# Altium project EDU_High-Speed-Design.PrjPcb (part 2 of 5)

## Sheet EDU_High-Speed-Design_CPU_Audio.SchDoc: CPU Audio
size 279 x 215 mm; Date: not used; ApprovedBy: not used; CheckedBy: not used; Author: not used; DrawnBy: not used; Engineer: Podlesnyi Vasilii; Organization: not used; Address4: not used; Revision: 0.1; SheetNumber: 25; SheetTotal: 27; ProjectTitle: EDU High-Speed Design; Time: not used; ImagePath: not used; Application_BuildNumber: not used
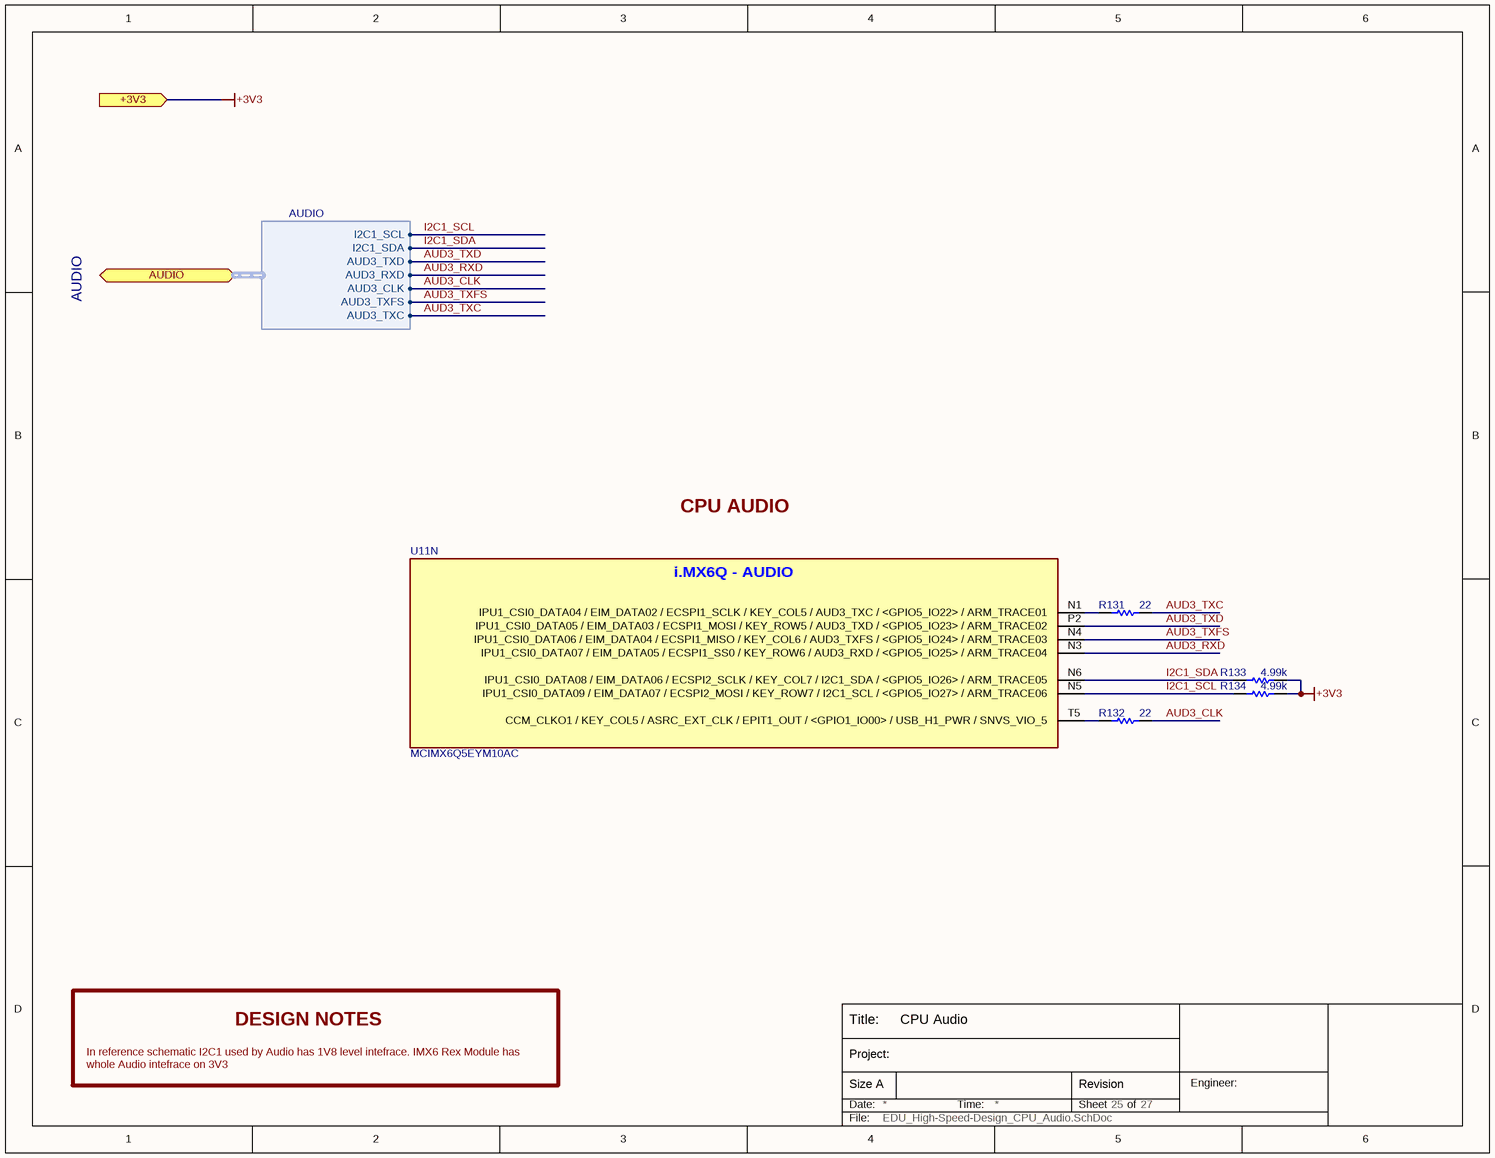
[diagram p9: EDU_High-Speed-Design_CPU_Audio.SchDoc]

### Parts
R131  22  [R0402]
R132  22  [R0402]
R133  4.99k  [R0402]
R134  4.99k  [R0402]
U11  MCIMX6Q5EYM10AC  [MCIMX6Q5EYM10AC]  (part N of 15)

### Ports
+3V3 (in), AUDIO (bidir, harness AUDIO)

### Harnesses
AUDIO: I2C1_SCL, AUD3_TXD, AUD3_RXD, I2C1_SDA, AUD3_CLK, AUD3_TXFS, AUD3_TXC

### Nets
+3V3: R133.2 R134.2 ; port +3V3
AUD3_CLK: R132.1 ; port AUDIO.AUD3_CLK
AUD3_RXD: U11.N3(IPU1_CSI0_DATA07_/_EIM_DATA05_/_ECSPI1_SS0_/_KEY_ROW6_/_AUD3_RXD_/_<GPIO5_IO25>_/_ARM_TRACE04) ; port AUDIO.AUD3_RXD
AUD3_TXC: R131.1 ; port AUDIO.AUD3_TXC
AUD3_TXD: U11.P2(IPU1_CSI0_DATA05_/_EIM_DATA03_/_ECSPI1_MOSI_/_KEY_ROW5_/_AUD3_TXD_/_<GPIO5_IO23>_/_ARM_TRACE02) ; port AUDIO.AUD3_TXD
AUD3_TXFS: U11.N4(IPU1_CSI0_DATA06_/_EIM_DATA04_/_ECSPI1_MISO_/_KEY_COL6_/_AUD3_TXFS_/_<GPIO5_IO24>_/_ARM_TRACE03) ; port AUDIO.AUD3_TXFS
I2C1_SCL: R134.1 U11.N5(IPU1_CSI0_DATA09_/_EIM_DATA07_/_ECSPI2_MOSI_/_KEY_ROW7_/_I2C1_SCL_/_<GPIO5_IO27>_/_ARM_TRACE06) ; port AUDIO.I2C1_SCL
I2C1_SDA: R133.1 U11.N6(IPU1_CSI0_DATA08_/_EIM_DATA06_/_ECSPI2_SCLK_/_KEY_COL7_/_I2C1_SDA_/_<GPIO5_IO26>_/_ARM_TRACE05) ; port AUDIO.I2C1_SDA
NetR131_2: R131.2 U11.N1(IPU1_CSI0_DATA04_/_EIM_DATA02_/_ECSPI1_SCLK_/_KEY_COL5_/_AUD3_TXC_/_<GPIO5_IO22>_/_ARM_TRACE01)
NetR132_2: R132.2 U11.T5(CCM_CLKO1_/_KEY_COL5_/_ASRC_EXT_CLK_/_EPIT1_OUT_/_<GPIO1_IO00>_/_USB_H1_PWR_/_SNVS_VIO_5)

### Notes on the sheet
- AUDIO
- CPU AUDIO
- DESIGN NOTES
- In reference schematic I2C1 used by Audio has 1V8 level intefrace. IMX6 Rex Module has whole Audio intefrace on 3V3
- Title:
- Date:
- Size A
- Project:
- Time:
- Sheet
- Revision
- of
- Engineer:
- File:
- (in symbol MCIMX6Q5EYM10AC, part N) i.MX6Q - AUDIO

### Library data of the parts
R131 R132 = RC0402FR-0722RL: as R154 on sheet EDU_High-Speed-Design_CPU_Control; Manufacturer Part Number 1: RC0402FR-0722RL; Resistance: 22; Supplier 1: Digi-Key; Supplier Part Number 1: 311-22.0LRCT-ND; ComponentLink1URL: http://www.yageo.com/documents/recent/PYu-RC0402_51_RoHS_L_6.pdf; ComponentLink1Description: http://www.yageo.com/documents/recent/PYu-RC0402_51_RoHS_L_6.pdf
R133 R134 = RMCF0402FT4K99: as R143 on sheet EDU_High-Speed-Design_CPU_Control; Manufacturer Part Number 1: RMCF0402FT4K99; Resistance: 4.99k; Supplier 1: Digi-Key; Supplier Part Number 1: RMCF0402FT4K99CT-ND; ComponentLink1URL: http://www.seielect.com/Catalog/SEI-RMCF.pdf; ComponentLink1Description: http://www.seielect.com/Catalog/SEI-RMCF.pdf
U11 = MCIMX6Q5EYM10AC: as U11 on sheet EDU_High-Speed-Design_CPU_Unused; Supplier 1: Digi-Key; Manufacturer Part Number 1: MCIMX6Q5EYM10AC; Supplier Part Number 1: MCIMX6Q5EYM10AC-ND

## Sheet EDU_High-Speed-Design_CPU_Ethernet.SchDoc: CPU Ethernet
size 279 x 215 mm; Date: not used; ApprovedBy: not used; CheckedBy: not used; Author: not used; DrawnBy: not used; Engineer: Podlesnyi Vasilii; Organization: not used; Address4: not used; Revision: 0.1; SheetNumber: 17; SheetTotal: 26; ProjectTitle: EDU High-Speed Design; Time: not used; ImagePath: not used; Application_BuildNumber: not used
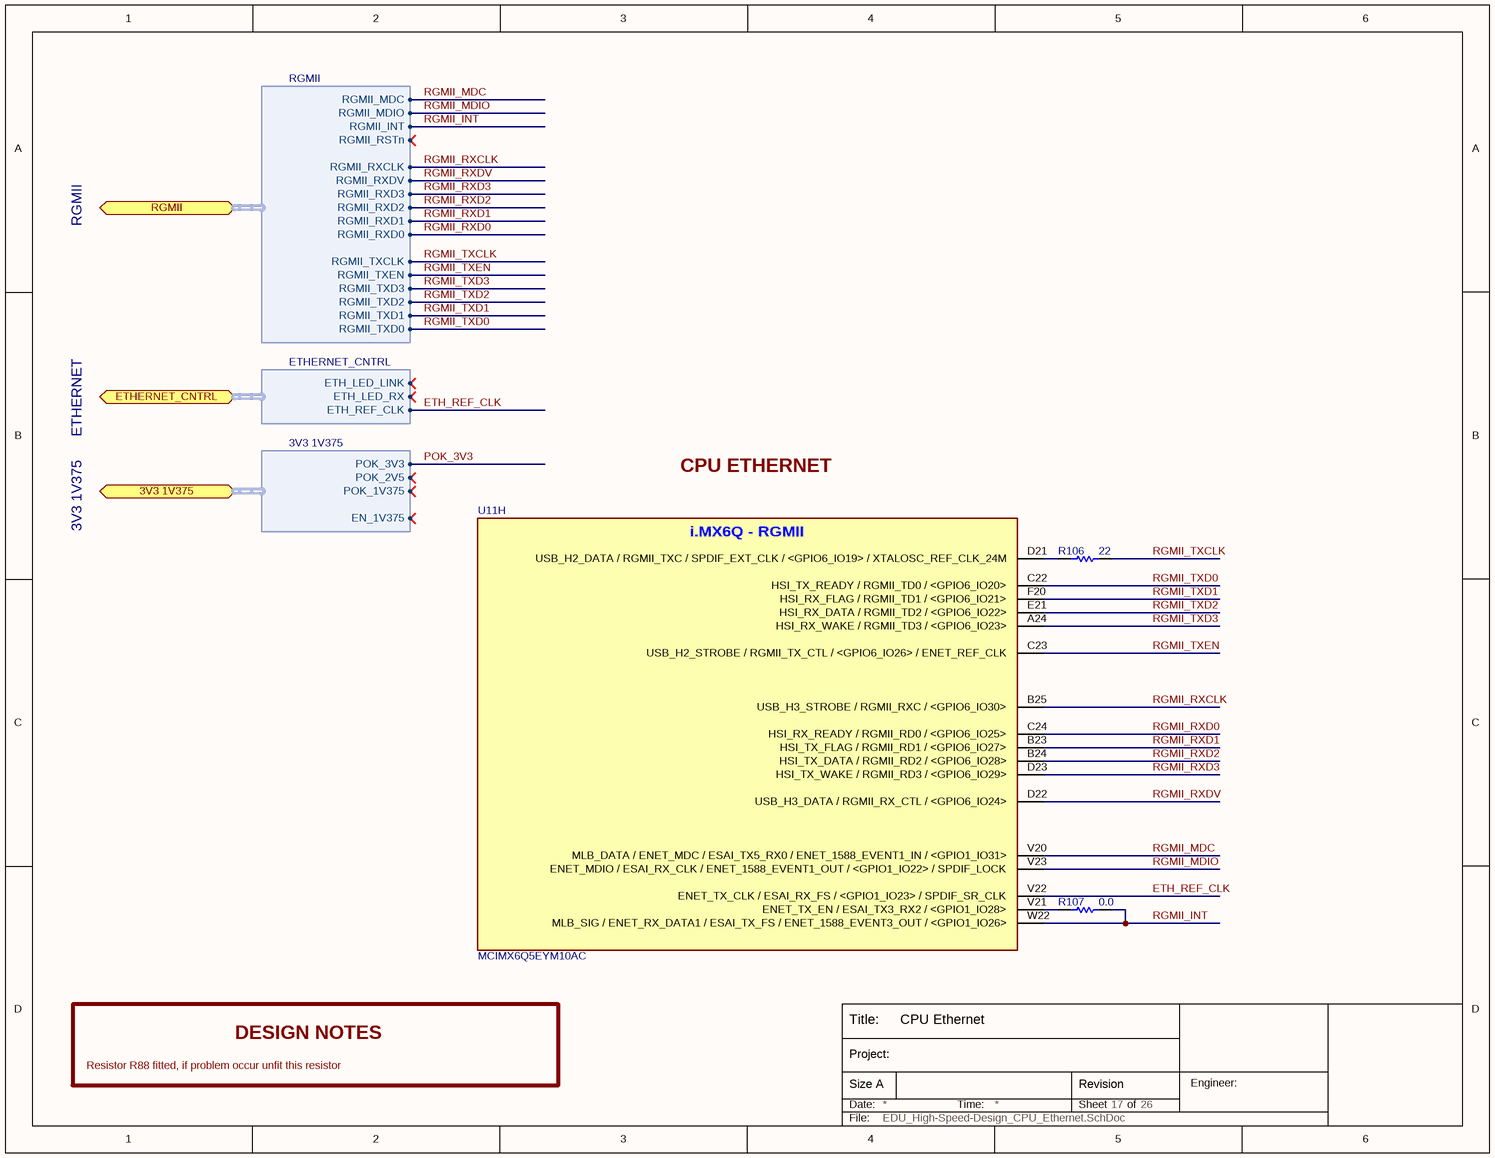
[diagram p10: EDU_High-Speed-Design_CPU_Ethernet.SchDoc]

### Parts
R106  22  [R0402]
R107  0.0  [R0402]
U11  MCIMX6Q5EYM10AC  [MCIMX6Q5EYM10AC]  (part H of 15)

### Ports
3V3 1V375 (bidir, harness 3V3 1V375), ETHERNET_CNTRL (bidir, harness ETHERNET_CNTRL), RGMII (bidir, harness RGMII)

### Harnesses
RGMII: RGMII_TXCLK, RGMII_TXEN, RGMII_TXD2, RGMII_TXD0, RGMII_TXD1, RGMII_TXD3, RGMII_RXDV, RGMII_RXCLK, RGMII_RXD3, RGMII_RXD2, RGMII_RXD1, RGMII_RXD0, RGMII_RSTn, RGMII_INT, RGMII_MDIO, RGMII_MDC
ETHERNET_CNTRL: ETH_LED_LINK, ETH_REF_CLK, ETH_LED_RX
3V3 1V375: POK_3V3, POK_1V375, POK_2V5, EN_1V375

### Nets
ETH_REF_CLK: U11.V22(ENET_TX_CLK_/_ESAI_RX_FS_/_<GPIO1_IO23>_/_SPDIF_SR_CLK) ; port ETHERNET_CNTRL.ETH_REF_CLK
RGMII_INT: R107.1 U11.W22(MLB_SIG_/_ENET_RX_DATA1_/_ESAI_TX_FS_/_ENET_1588_EVENT3_OUT_/_<GPIO1_IO26>) ; port RGMII.RGMII_INT
RGMII_MDC: U11.V20(MLB_DATA_/_ENET_MDC_/_ESAI_TX5_RX0_/_ENET_1588_EVENT1_IN_/_<GPIO1_IO31>) ; port RGMII.RGMII_MDC
RGMII_MDIO: U11.V23(ENET_MDIO_/_ESAI_RX_CLK_/_ENET_1588_EVENT1_OUT_/_<GPIO1_IO22>_/_SPDIF_LOCK) ; port RGMII.RGMII_MDIO
RGMII_RXCLK: U11.B25(USB_H3_STROBE_/_RGMII_RXC_/_<GPIO6_IO30>) ; port RGMII.RGMII_RXCLK
RGMII_RXD0: U11.C24(HSI_RX_READY_/_RGMII_RD0_/_<GPIO6_IO25>) ; port RGMII.RGMII_RXD0
RGMII_RXD1: U11.B23(HSI_TX_FLAG_/_RGMII_RD1_/_<GPIO6_IO27>) ; port RGMII.RGMII_RXD1
RGMII_RXD2: U11.B24(HSI_TX_DATA_/_RGMII_RD2_/_<GPIO6_IO28>) ; port RGMII.RGMII_RXD2
RGMII_RXD3: U11.D23(HSI_TX_WAKE_/_RGMII_RD3_/_<GPIO6_IO29>) ; port RGMII.RGMII_RXD3
RGMII_RXDV: U11.D22(USB_H3_DATA_/_RGMII_RX_CTL_/_<GPIO6_IO24>) ; port RGMII.RGMII_RXDV
RGMII_TXCLK: R106.1 ; port RGMII.RGMII_TXCLK
RGMII_TXD0: U11.C22(HSI_TX_READY_/_RGMII_TD0_/_<GPIO6_IO20>) ; port RGMII.RGMII_TXD0
RGMII_TXD1: U11.F20(HSI_RX_FLAG_/_RGMII_TD1_/_<GPIO6_IO21>) ; port RGMII.RGMII_TXD1
RGMII_TXD2: U11.E21(HSI_RX_DATA_/_RGMII_TD2_/_<GPIO6_IO22>) ; port RGMII.RGMII_TXD2
RGMII_TXD3: U11.A24(HSI_RX_WAKE_/_RGMII_TD3_/_<GPIO6_IO23>) ; port RGMII.RGMII_TXD3
RGMII_TXEN: U11.C23(USB_H2_STROBE_/_RGMII_TX_CTL_/_<GPIO6_IO26>_/_ENET_REF_CLK) ; port RGMII.RGMII_TXEN
NetR106_2: R106.2 U11.D21(USB_H2_DATA_/_RGMII_TXC_/_SPDIF_EXT_CLK_/_<GPIO6_IO19>_/_XTALOSC_REF_CLK_24M)
NetR107_2: R107.2 U11.V21(ENET_TX_EN_/_ESAI_TX3_RX2_/_<GPIO1_IO28>)

### Notes on the sheet
- RGMII
- ETHERNET
- CPU ETHERNET
- 3V3 1V375
- DESIGN NOTES
- Resistor R88 fitted, if problem occur unfit this resistor
- Title:
- Date:
- Size A
- Project:
- Time:
- Sheet
- Revision
- of
- Engineer:
- File:
- (in symbol MCIMX6Q5EYM10AC, part H) i.MX6Q - RGMII

### Library data of the parts
R106 = RC0402FR-0722RL: as R154 on sheet EDU_High-Speed-Design_CPU_Control; Manufacturer Part Number 1: RC0402FR-0722RL; Resistance: 22; Supplier 1: Digi-Key; Supplier Part Number 1: 311-22.0LRCT-ND; ComponentLink1URL: http://www.yageo.com/documents/recent/PYu-RC0402_51_RoHS_L_6.pdf; ComponentLink1Description: http://www.yageo.com/documents/recent/PYu-RC0402_51_RoHS_L_6.pdf
R107 = RC0402JR-070RL: as R76 on sheet EDU_High-Speed-Design_CPU_Power; Manufacturer Part Number 1: RC0402JR-070RL; Resistance: 0.0; Supplier 1: Digi-Key; Supplier Part Number 1: 311-0.0JRCT-ND; ComponentLink1URL: http://www.yageo.com/documents/recent/PYu-RC0402_51_RoHS_L_6.pdf; ComponentLink1Description: http://www.yageo.com/documents/recent/PYu-RC0402_51_RoHS_L_6.pdf
U11 = MCIMX6Q5EYM10AC: as U11 on sheet EDU_High-Speed-Design_CPU_Unused; Supplier 1: Digi-Key; Manufacturer Part Number 1: MCIMX6Q5EYM10AC; Supplier Part Number 1: MCIMX6Q5EYM10AC-ND

## Sheet EDU_High-Speed-Design_CPU_USB.SchDoc: CPU USB
size 279 x 215 mm; Date: not used; ApprovedBy: not used; CheckedBy: not used; Author: not used; DrawnBy: not used; Engineer: Podlesnyi Vasilii; Organization: not used; Address4: not used; Revision: 0.1; SheetNumber: 18; SheetTotal: 26; ProjectTitle: EDU High-Speed Design; Time: not used; ImagePath: not used; Application_BuildNumber: not used
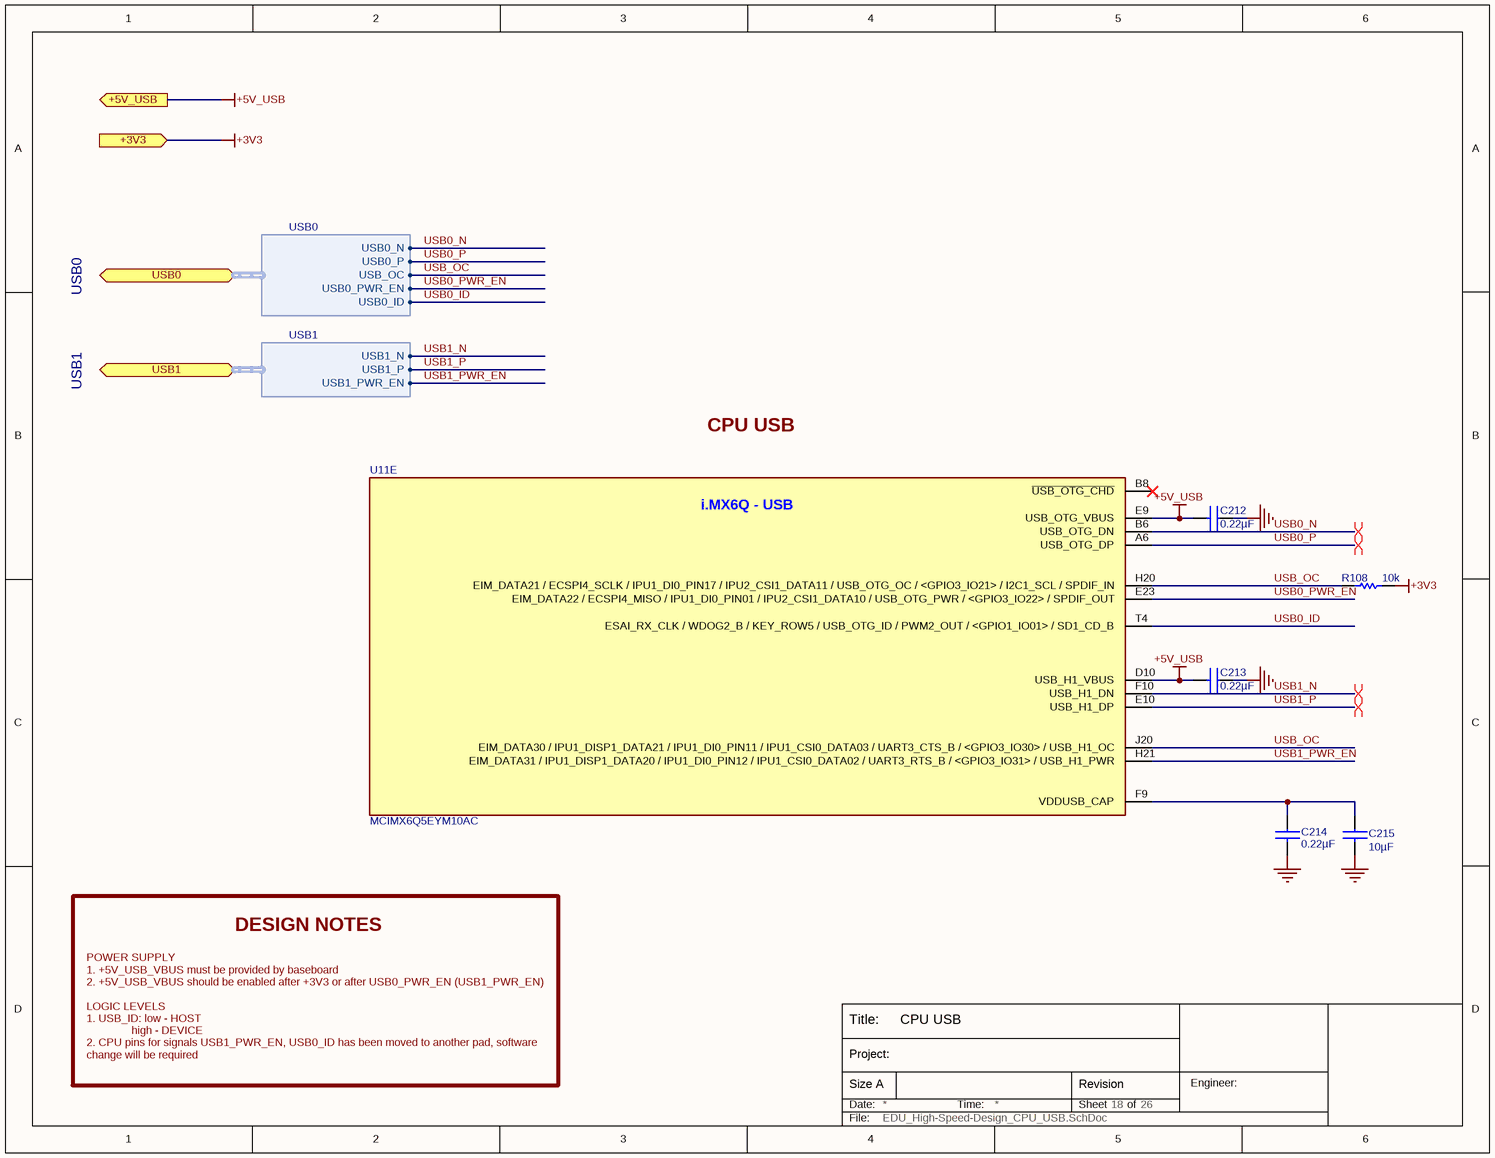
[diagram p11: EDU_High-Speed-Design_CPU_USB.SchDoc]

### Parts
C212  0.22µF  [C0402]
C213  0.22µF  [C0402]
C214  0.22µF  [C0402]
C215  10µF  [C0603]
R108  10k  [R0402]
U11  MCIMX6Q5EYM10AC  [MCIMX6Q5EYM10AC]  (part E of 15)

### Ports
+3V3 (in), +5V_USB (out), USB0 (bidir, harness USB0), USB1 (bidir, harness USB1)

### Harnesses
USB0: USB0_N, USB_OC, USB0_PWR_EN, USB0_P, USB0_ID
USB1: USB1_N, USB1_PWR_EN, USB1_P

### Nets
+3V3: R108.2 ; port +3V3
+5V_USB: C212.2 C213.2 U11.D10(USB_H1_VBUS) U11.E9(USB_OTG_VBUS) ; port +5V_USB
GND: C212.1 C213.1 C214.2 C215.2
USB0_ID: U11.T4(ESAI_RX_CLK_/_WDOG2_B_/_KEY_ROW5_/_USB_OTG_ID_/_PWM2_OUT_/_<GPIO1_IO01>_/_SD1_CD_B) ; port USB0.USB0_ID
USB0_N: U11.B6(USB_OTG_DN) ; port USB0.USB0_N
USB0_P: U11.A6(USB_OTG_DP) ; port USB0.USB0_P
USB0_PWR_EN: U11.E23(EIM_DATA22_/_ECSPI4_MISO_/_IPU1_DI0_PIN01_/_IPU2_CSI1_DATA10_/_USB_OTG_PWR_/_<GPIO3_IO22>_/_SPDIF_OUT) ; port USB0.USB0_PWR_EN
USB1_N: U11.F10(USB_H1_DN) ; port USB1.USB1_N
USB1_P: U11.E10(USB_H1_DP) ; port USB1.USB1_P
USB1_PWR_EN: U11.H21(EIM_DATA31_/_IPU1_DISP1_DATA20_/_IPU1_DI0_PIN12_/_IPU1_CSI0_DATA02_/_UART3_RTS_B_/_<GPIO3_IO31>_/_USB_H1_PWR) ; port USB1.USB1_PWR_EN
USB_OC: R108.1 U11.H20(EIM_DATA21_/_ECSPI4_SCLK_/_IPU1_DI0_PIN17_/_IPU2_CSI1_DATA11_/_USB_OTG_OC_/_<GPIO3_IO21>_/_I2C1_SCL_/_SPDIF_IN) U11.J20(EIM_DATA30_/_IPU1_DISP1_DATA21_/_IPU1_DI0_PIN11_/_IPU1_CSI0_DATA03_/_UART3_CTS_B_/_<GPIO3_IO30>_/_USB_H1_OC) ; port USB0.USB_OC
NetC214_1: C214.1 C215.1 U11.F9(VDDUSB_CAP)

Not connected (* = marked no-connect by the designer): U11 B8(~{USB_OTG_CHD})*

### Layout directives
differential pair: USB0_N, USB0_P, USB1_N, USB1_P

### Notes on the sheet
- USB0
- USB1
- CPU USB
- DESIGN NOTES
- POWER SUPPLY
  1. +5V_USB_VBUS must be provided by baseboard
  2. +5V_USB_VBUS should be enabled after +3V3 or after USB0_PWR_EN (USB1_PWR_EN)
  LOGIC LEVELS
  1. USB_ID: low - HOST
  high - DEVICE
  2. CPU pins for signals USB1_PWR_EN, USB0_ID has been moved to another pad, software change will be required
- Title:
- Date:
- Size A
- Project:
- Time:
- Sheet
- Revision
- of
- Engineer:
- File:
- (in symbol MCIMX6Q5EYM10AC, part E) i.MX6Q - USB

### Library data of the parts
C212-C214 = C1005X5R1E224M: as C125 on sheet EDU_High-Speed-Design_CPU_Power; Capacitance: 0.22µF; Manufacturer Part Number 1: C1005X5R1E224M; Voltage: 25V; Supplier 1: Digi-Key; Supplier Part Number 1: 445-5945-1-ND; ComponentLink1URL: http://www.tdk.co.jp/tefe02/e412_c.pdf; ComponentLink1Description: http://www.tdk.co.jp/tefe02/e412_c.pdf
C215 = C1608X5R0J106M: CAP CER 10UF 6.3V X5R 20% 0603; Manufacturer 1: TDK Corporation; Capacitance: 10µF; Manufacturer Part Number 1: C1608X5R0J106M; Voltage: 6.3V; Supplier 1: Digi-Key; Supplier Part Number 1: 445-4112-1-ND; ComponentLink1URL: http://www.tdk.com/pdf/general_B11.pdf; ComponentLink1Description: http://www.tdk.com/pdf/general_B11.pdf
R108 = RC0402FR-0710KL: as R135 on sheet EDU_High-Speed-Design_CPU_Control; Manufacturer Part Number 1: RC0402FR-0710KL; Resistance: 10k; Supplier 1: Digi-Key; Supplier Part Number 1: 311-10.0KLRCT-ND; ComponentLink1URL: http://www.yageo.com/documents/recent/PYu-RC0402_51_RoHS_L_6.pdf; ComponentLink1Description: http://www.yageo.com/documents/recent/PYu-RC0402_51_RoHS_L_6.pdf
U11 = MCIMX6Q5EYM10AC: as U11 on sheet EDU_High-Speed-Design_CPU_Unused; Supplier 1: Digi-Key; Manufacturer Part Number 1: MCIMX6Q5EYM10AC; Supplier Part Number 1: MCIMX6Q5EYM10AC-ND

## Sheet EDU_High-Speed-Design_CPU_LVDS.SchDoc: CPU LVDS
size 279 x 215 mm; Date: not used; ApprovedBy: not used; CheckedBy: not used; Author: not used; DrawnBy: not used; Engineer: Podlesnyi Vasilii; Organization: not used; Address4: not used; Revision: 0.1; SheetNumber: 21; SheetTotal: 26; ProjectTitle: EDU High-Speed Design; Time: not used; ImagePath: not used; Application_BuildNumber: not used
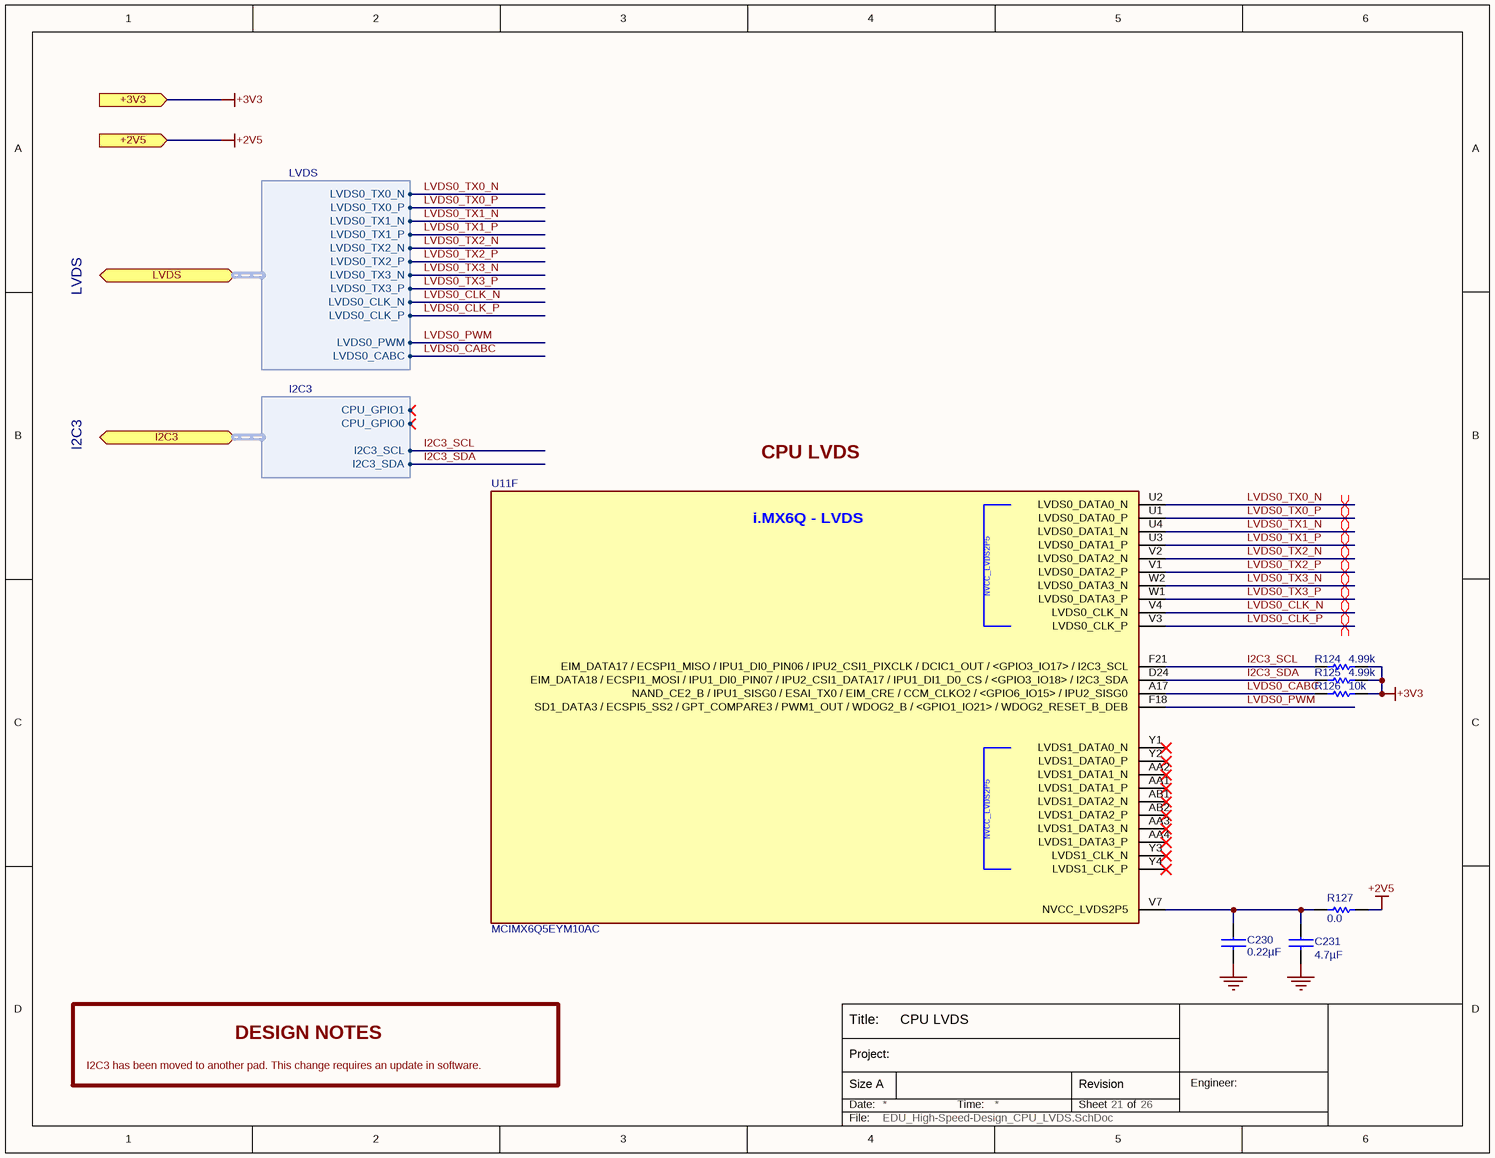
[diagram p12: EDU_High-Speed-Design_CPU_LVDS.SchDoc]

### Parts
C230  0.22µF  [C0402]
C231  4.7µF  [C0402]
R124  4.99k  [R0402]
R125  4.99k  [R0402]
R126  10k  [R0402]
R127  0.0  [R0402]
U11  MCIMX6Q5EYM10AC  [MCIMX6Q5EYM10AC]  (part F of 15)

### Ports
+2V5 (in), +3V3 (in), I2C3 (bidir, harness I2C3), LVDS (bidir, harness LVDS)

### Harnesses
LVDS: LVDS0_TX0_N, LVDS0_TX1_P, LVDS0_TX2_N, LVDS0_TX1_N, LVDS0_TX2_P, LVDS0_TX0_P, LVDS0_TX3_N, LVDS0_TX3_P, LVDS0_CLK_N, LVDS0_CLK_P, LVDS0_PWM, LVDS0_CABC
I2C3: CPU_GPIO0, I2C3_SCL, CPU_GPIO1, I2C3_SDA

### Nets
+2V5: R127.2 ; port +2V5
+3V3: R124.1 R125.1 R126.2 ; port +3V3
GND: C230.2 C231.2
I2C3_SCL: R124.2 U11.F21(EIM_DATA17_/_ECSPI1_MISO_/_IPU1_DI0_PIN06_/_IPU2_CSI1_PIXCLK_/_DCIC1_OUT_/_<GPIO3_IO17>_/_I2C3_SCL) ; port I2C3.I2C3_SCL
I2C3_SDA: R125.2 U11.D24(EIM_DATA18_/_ECSPI1_MOSI_/_IPU1_DI0_PIN07_/_IPU2_CSI1_DATA17_/_IPU1_DI1_D0_CS_/_<GPIO3_IO18>_/_I2C3_SDA) ; port I2C3.I2C3_SDA
LVDS0_CABC: R126.1 U11.A17(NAND_CE2_B_/_IPU1_SISG0_/_ESAI_TX0_/_EIM_CRE_/_CCM_CLKO2_/_<GPIO6_IO15>_/_IPU2_SISG0) ; port LVDS.LVDS0_CABC
LVDS0_CLK_N: U11.V4(LVDS0_CLK_N) ; port LVDS.LVDS0_CLK_N
LVDS0_CLK_P: U11.V3(LVDS0_CLK_P) ; port LVDS.LVDS0_CLK_P
LVDS0_PWM: U11.F18(SD1_DATA3_/_ECSPI5_SS2_/_GPT_COMPARE3_/_PWM1_OUT_/_WDOG2_B_/_<GPIO1_IO21>_/_WDOG2_RESET_B_DEB) ; port LVDS.LVDS0_PWM
LVDS0_TX0_N: U11.U2(LVDS0_DATA0_N) ; port LVDS.LVDS0_TX0_N
LVDS0_TX0_P: U11.U1(LVDS0_DATA0_P) ; port LVDS.LVDS0_TX0_P
LVDS0_TX1_N: U11.U4(LVDS0_DATA1_N) ; port LVDS.LVDS0_TX1_N
LVDS0_TX1_P: U11.U3(LVDS0_DATA1_P) ; port LVDS.LVDS0_TX1_P
LVDS0_TX2_N: U11.V2(LVDS0_DATA2_N) ; port LVDS.LVDS0_TX2_N
LVDS0_TX2_P: U11.V1(LVDS0_DATA2_P) ; port LVDS.LVDS0_TX2_P
LVDS0_TX3_N: U11.W2(LVDS0_DATA3_N) ; port LVDS.LVDS0_TX3_N
LVDS0_TX3_P: U11.W1(LVDS0_DATA3_P) ; port LVDS.LVDS0_TX3_P
NetC230_1: C230.1 C231.1 R127.1 U11.V7(NVCC_LVDS2P5)

Not connected (* = marked no-connect by the designer): U11 AA1(LVDS1_DATA1_P)* AA2(LVDS1_DATA1_N)* AA3(LVDS1_DATA3_N)* AA4(LVDS1_DATA3_P)* AB1(LVDS1_DATA2_N)* AB2(LVDS1_DATA2_P)* Y1(LVDS1_DATA0_N)* Y2(LVDS1_DATA0_P)* Y3(LVDS1_CLK_N)* Y4(LVDS1_CLK_P)*

### Layout directives
differential pair: LVDS0_CLK_N, LVDS0_CLK_P, LVDS0_TX0_N, LVDS0_TX0_P, LVDS0_TX1_N, LVDS0_TX1_P, LVDS0_TX2_N, LVDS0_TX2_P, LVDS0_TX3_N, LVDS0_TX3_P

### Notes on the sheet
- LVDS
- I2C3
- CPU LVDS
- DESIGN NOTES
- I2C3 has been moved to another pad. This change requires an update in software.
- Title:
- Date:
- Size A
- Project:
- Time:
- Sheet
- Revision
- of
- Engineer:
- File:
- (in symbol MCIMX6Q5EYM10AC, part F) i.MX6Q - LVDS

### Library data of the parts
C230 = C1005X5R1E224M: CAP CER .22UF 25V X5R 20% 0402; Manufacturer 1: TDK Corporation; Capacitance: 0.22µF; Manufacturer Part Number 1: C1005X5R1E224M; Voltage: 25V; Supplier 1: Digi-Key; Supplier Part Number 1: 445-5945-1-ND; ComponentLink1URL: http://www.tdk.co.jp/tefe02/e412_c.pdf; ComponentLink1Description: http://www.tdk.co.jp/tefe02/e412_c.pdf
C231 = C1005X5R1A475M: CAP CER 4.7UF 10V 20% X5R 0402; Manufacturer 1: TDK Corporation; Supplier 1: Digi-Key; Supplier Part Number 1: 445-8023-1-ND; Manufacturer Part Number 1: C1005X5R1A475M; Capacitance: 4.7µF; Voltage: 10V; ComponentLink1URL: http://www.tdk.com/pdf/general_B11.pdf; ComponentLink1Description: http://www.tdk.com/pdf/general_B11.pdf
R124 R125 = RMCF0402FT4K99: RES TF 4.99K OHM 1% 1/16W 0402; Manufacturer 1: Stackpole Electronics Inc; Manufacturer Part Number 1: RMCF0402FT4K99; Resistance: 4.99k; Supplier 1: Digi-Key; Supplier Part Number 1: RMCF0402FT4K99CT-ND; ComponentLink1URL: http://www.seielect.com/Catalog/SEI-RMCF.pdf; ComponentLink1Description: http://www.seielect.com/Catalog/SEI-RMCF.pdf
R126 = RC0402FR-0710KL: RES 10.0K OHM 1/16W 1% 0402 SMD; Manufacturer 1: Yageo; Manufacturer Part Number 1: RC0402FR-0710KL; Resistance: 10k; Supplier 1: Digi-Key; Supplier Part Number 1: 311-10.0KLRCT-ND; ComponentLink1URL: http://www.yageo.com/documents/recent/PYu-RC0402_51_RoHS_L_6.pdf; ComponentLink1Description: http://www.yageo.com/documents/recent/PYu-RC0402_51_RoHS_L_6.pdf
R127 = RC0402JR-070RL: RES 0.0 OHM 1/16W 0402 SMD; Manufacturer 1: Yageo; Manufacturer Part Number 1: RC0402JR-070RL; Resistance: 0.0; Supplier 1: Digi-Key; Supplier Part Number 1: 311-0.0JRCT-ND; ComponentLink1URL: http://www.yageo.com/documents/recent/PYu-RC0402_51_RoHS_L_6.pdf; ComponentLink1Description: http://www.yageo.com/documents/recent/PYu-RC0402_51_RoHS_L_6.pdf
U11 = MCIMX6Q5EYM10AC: IC MCU 32BIT ARM QUAD 624FCBGA; Manufacturer 1: Freescale Semiconductor; Supplier 1: Digi-Key; Manufacturer Part Number 1: MCIMX6Q5EYM10AC; Supplier Part Number 1: MCIMX6Q5EYM10AC-ND

## Sheet EDU_High-Speed-Design_CPU_HDMI.SchDoc: CPU HDMI
size 279 x 215 mm; Date: not used; ApprovedBy: not used; CheckedBy: not used; Author: not used; DrawnBy: not used; Engineer: Podlesnyi Vasilii; Organization: not used; Address4: not used; Revision: 0.1; SheetNumber: 19; SheetTotal: 26; ProjectTitle: EDU High-Speed Design; Time: not used; ImagePath: not used; Application_BuildNumber: not used
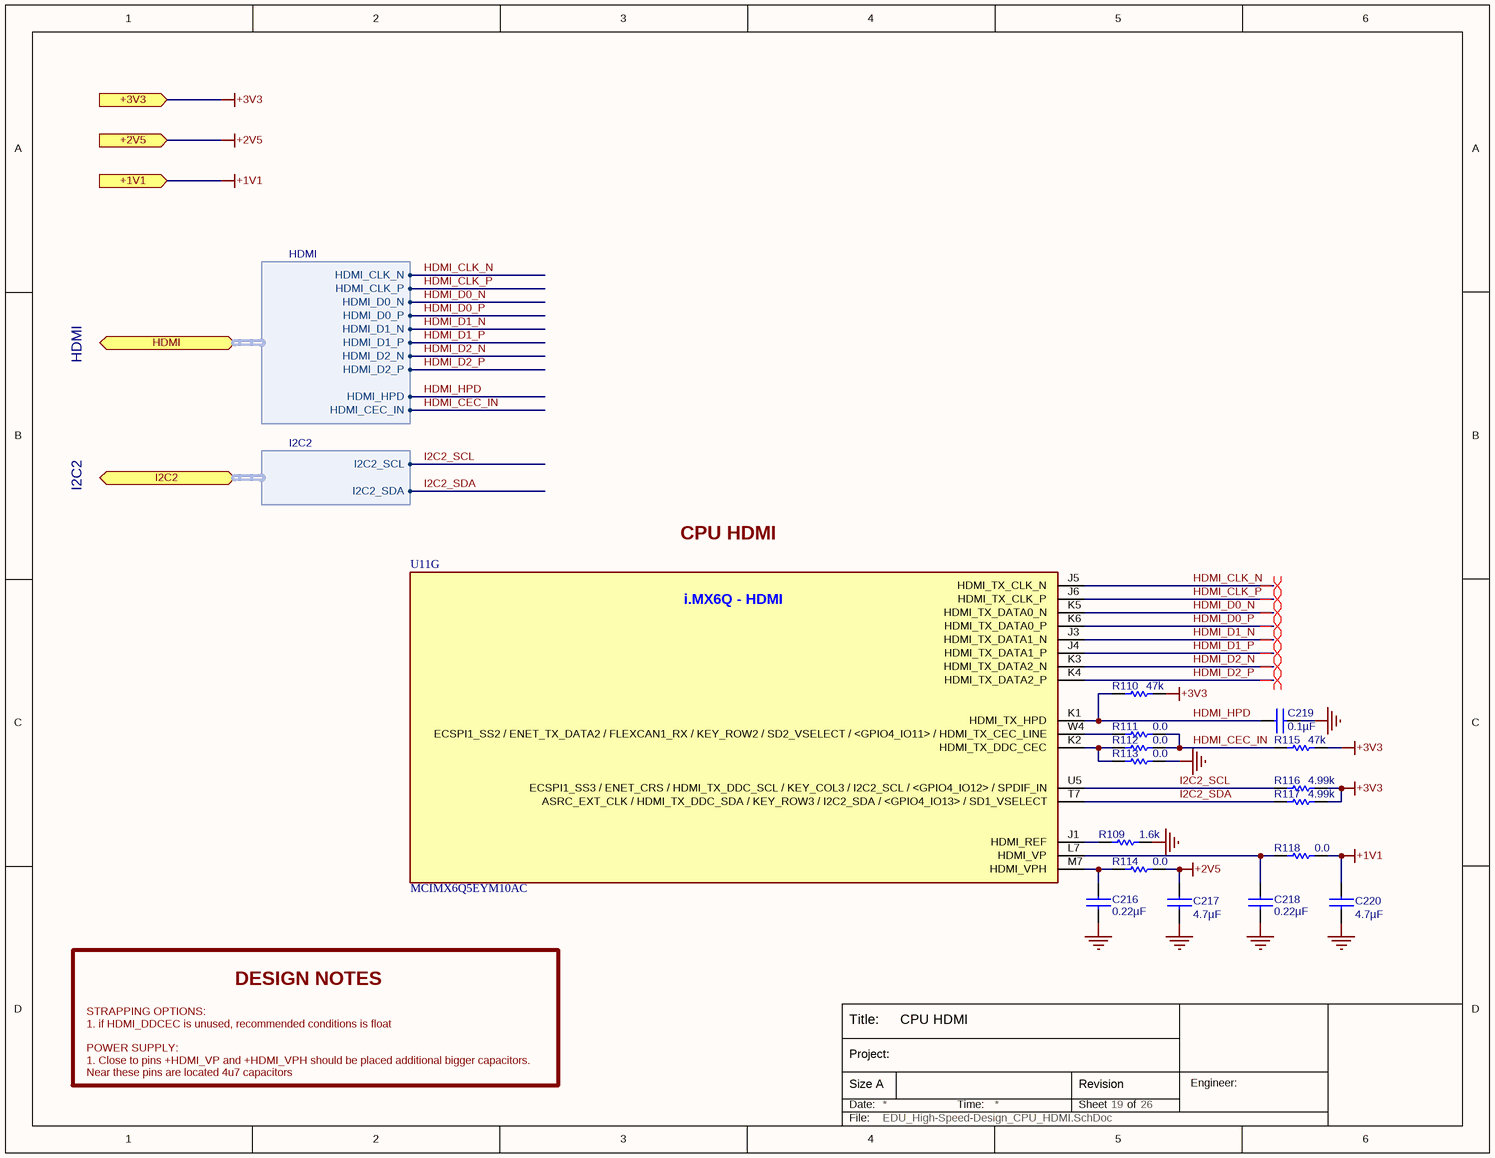
[diagram p13: EDU_High-Speed-Design_CPU_HDMI.SchDoc]

### Parts
C216  0.22µF  [C0402]
C217  4.7µF  [C0402]
C218  0.22µF  [C0402]
C219  0.1µF  [C0402]
C220  4.7µF  [C0402]
R109  1.6k  [R0402]
R110  47k  [R0402]
R111  0.0  [R0402]
R112  0.0  [R0402]
R113  0.0  [R0402]
R114  0.0  [R0402]
R115  47k  [R0402]
R116  4.99k  [R0402]
R117  4.99k  [R0402]
R118  0.0  [R0402]
U11  MCIMX6Q5EYM10AC  [MCIMX6Q5EYM10AC]  (part G of 15)

### Ports
+1V1 (in), +2V5 (in), +3V3 (in), HDMI (bidir, harness HDMI), I2C2 (bidir, harness I2C2)

### Harnesses
HDMI: HDMI_CLK_N, HDMI_D0_P, HDMI_D1_N, HDMI_D0_N, HDMI_D1_P, HDMI_CLK_P, HDMI_D2_N, HDMI_D2_P, HDMI_HPD, HDMI_CEC_IN
I2C2: I2C2_SCL, I2C2_SDA

### Nets
+1V1: C220.1 R118.2 ; port +1V1
+2V5: C217.1 R114.2 ; port +2V5
+3V3: R110.1 R115.1 R116.1 R117.1 ; port +3V3
GND: C216.2 C217.2 C218.2 C219.2 C220.2 R109.1 R113.1
HDMI_CEC_IN: R111.1 R112.1 R115.2 ; port HDMI.HDMI_CEC_IN
HDMI_CLK_N: U11.J5(HDMI_TX_CLK_N) ; port HDMI.HDMI_CLK_N
HDMI_CLK_P: U11.J6(HDMI_TX_CLK_P) ; port HDMI.HDMI_CLK_P
HDMI_D0_N: U11.K5(HDMI_TX_DATA0_N) ; port HDMI.HDMI_D0_N
HDMI_D0_P: U11.K6(HDMI_TX_DATA0_P) ; port HDMI.HDMI_D0_P
HDMI_D1_N: U11.J3(HDMI_TX_DATA1_N) ; port HDMI.HDMI_D1_N
HDMI_D1_P: U11.J4(HDMI_TX_DATA1_P) ; port HDMI.HDMI_D1_P
HDMI_D2_N: U11.K3(HDMI_TX_DATA2_N) ; port HDMI.HDMI_D2_N
HDMI_D2_P: U11.K4(HDMI_TX_DATA2_P) ; port HDMI.HDMI_D2_P
HDMI_HPD: C219.1 R110.2 U11.K1(HDMI_TX_HPD) ; port HDMI.HDMI_HPD
I2C2_SCL: R116.2 U11.U5(ECSPI1_SS3_/_ENET_CRS_/_HDMI_TX_DDC_SCL_/_KEY_COL3_/_I2C2_SCL_/_<GPIO4_IO12>_/_SPDIF_IN) ; port I2C2.I2C2_SCL
I2C2_SDA: R117.2 U11.T7(ASRC_EXT_CLK_/_HDMI_TX_DDC_SDA_/_KEY_ROW3_/_I2C2_SDA_/_<GPIO4_IO13>_/_SD1_VSELECT) ; port I2C2.I2C2_SDA
NetC216_1: C216.1 R114.1 U11.M7(HDMI_VPH)
NetC218_1: C218.1 R118.1 U11.L7(HDMI_VP)
NetR109_2: R109.2 U11.J1(HDMI_REF)
NetR111_2: R111.2 U11.W4(ECSPI1_SS2_/_ENET_TX_DATA2_/_FLEXCAN1_RX_/_KEY_ROW2_/_SD2_VSELECT_/_<GPIO4_IO11>_/_HDMI_TX_CEC_LINE)
NetR112_2: R112.2 R113.2 U11.K2(HDMI_TX_DDC_CEC)

### Layout directives
differential pair: HDMI_CLK_N, HDMI_CLK_P, HDMI_D0_N, HDMI_D0_P, HDMI_D1_N, HDMI_D1_P, HDMI_D2_N, HDMI_D2_P

### Notes on the sheet
- HDMI
- I2C2
- CPU HDMI
- DESIGN NOTES
- STRAPPING OPTIONS:
  1. if HDMI_DDCEC is unused, recommended conditions is float
  POWER SUPPLY:
  1. Close to pins +HDMI_VP and +HDMI_VPH should be placed additional bigger capacitors. Near these pins are located 4u7 capacitors
- Title:
- Date:
- Size A
- Project:
- Time:
- Sheet
- Revision
- of
- Engineer:
- File:
- (in symbol MCIMX6Q5EYM10AC, part G) i.MX6Q - HDMI

### Library data of the parts
C216 C218 = C1005X5R1E224M: as C230 on sheet EDU_High-Speed-Design_CPU_LVDS; Capacitance: 0.22µF; Manufacturer Part Number 1: C1005X5R1E224M; Voltage: 25V; Supplier 1: Digi-Key; Supplier Part Number 1: 445-5945-1-ND; ComponentLink1URL: http://www.tdk.co.jp/tefe02/e412_c.pdf; ComponentLink1Description: http://www.tdk.co.jp/tefe02/e412_c.pdf
C217 C220 = C1005X5R1A475M: as C231 on sheet EDU_High-Speed-Design_CPU_LVDS; Supplier 1: Digi-Key; Supplier Part Number 1: 445-8023-1-ND; Manufacturer Part Number 1: C1005X5R1A475M; Capacitance: 4.7µF; Voltage: 10V; ComponentLink1URL: http://www.tdk.com/pdf/general_B11.pdf; ComponentLink1Description: http://www.tdk.com/pdf/general_B11.pdf
C219 = C1005X5R1H104K: CAP CER .10UF 50V X5R 10% 0402; Manufacturer 1: TDK Corporation; Capacitance: 0.1µF; Manufacturer Part Number 1: C1005X5R1H104K; Voltage: 50V; Supplier 1: Digi-Key; Supplier Part Number 1: 445-5942-1-ND; ComponentLink1URL: http://www.tdk.co.jp/tefe02/e412_c.pdf; ComponentLink1Description: http://www.tdk.co.jp/tefe02/e412_c.pdf
R109 = ERJ-2RKF1601X: RES 1.6K OHM 1/10W 1% 0402 SMD; Manufacturer 1: Panasonic Electronic Components; Supplier 1: Digi-Key; Manufacturer Part Number 1: ERJ-2RKF1601X; Resistance: 1.6k; ComponentLink1URL: http://industrial.panasonic.com/www-cgi/jvcr13pz.cgi?E+PZ+3+AOA0002+ERJ2RKF1601X+7+WW; ComponentLink1Description: http://industrial.panasonic.com/www-cgi/jvcr13pz.cgi?E+PZ+3+AOA0002+ERJ2RKF1601X+7+WW; Supplier Part Number 1: P1.60KLCT-ND
R110 R115 = RC0402FR-0747KL: RES 47.0K OHM 1/16W 1% 0402 SMD; Manufacturer: Yageo; Manufacturer Part Number: RC0402FR-0747KL; Resistance: 47k; Supplier 1: Digi-Key; Supplier Part Number 1: 311-47.0KLRCT-ND; ComponentLink1URL: http://www.yageo.com/documents/recent/PYu-RC0402_51_RoHS_L_6.pdf; ComponentLink1Description: http://www.yageo.com/documents/recent/PYu-RC0402_51_RoHS_L_6.pdf
R111-R114 R118 = RC0402JR-070RL: as R127 on sheet EDU_High-Speed-Design_CPU_LVDS; Manufacturer Part Number 1: RC0402JR-070RL; Resistance: 0.0; Supplier 1: Digi-Key; Supplier Part Number 1: 311-0.0JRCT-ND; ComponentLink1URL: http://www.yageo.com/documents/recent/PYu-RC0402_51_RoHS_L_6.pdf; ComponentLink1Description: http://www.yageo.com/documents/recent/PYu-RC0402_51_RoHS_L_6.pdf
R116 R117 = RMCF0402FT4K99: as R124 on sheet EDU_High-Speed-Design_CPU_LVDS; Manufacturer Part Number 1: RMCF0402FT4K99; Resistance: 4.99k; Supplier 1: Digi-Key; Supplier Part Number 1: RMCF0402FT4K99CT-ND; ComponentLink1URL: http://www.seielect.com/Catalog/SEI-RMCF.pdf; ComponentLink1Description: http://www.seielect.com/Catalog/SEI-RMCF.pdf
U11 = MCIMX6Q5EYM10AC: as U11 on sheet EDU_High-Speed-Design_CPU_LVDS; Supplier 1: Digi-Key; Manufacturer Part Number 1: MCIMX6Q5EYM10AC; Supplier Part Number 1: MCIMX6Q5EYM10AC-ND

## Sheet EDU_High-Speed-Design_CPU_PCIe.SchDoc: CPU PCIe
size 279 x 215 mm; Date: not used; ApprovedBy: not used; CheckedBy: not used; Author: not used; DrawnBy: not used; Engineer: Podlesnyi Vasilii; Organization: not used; Address4: not used; Revision: 0.1; SheetNumber: 20; SheetTotal: 26; ProjectTitle: EDU High-Speed Design; Time: not used; ImagePath: not used; Application_BuildNumber: not used
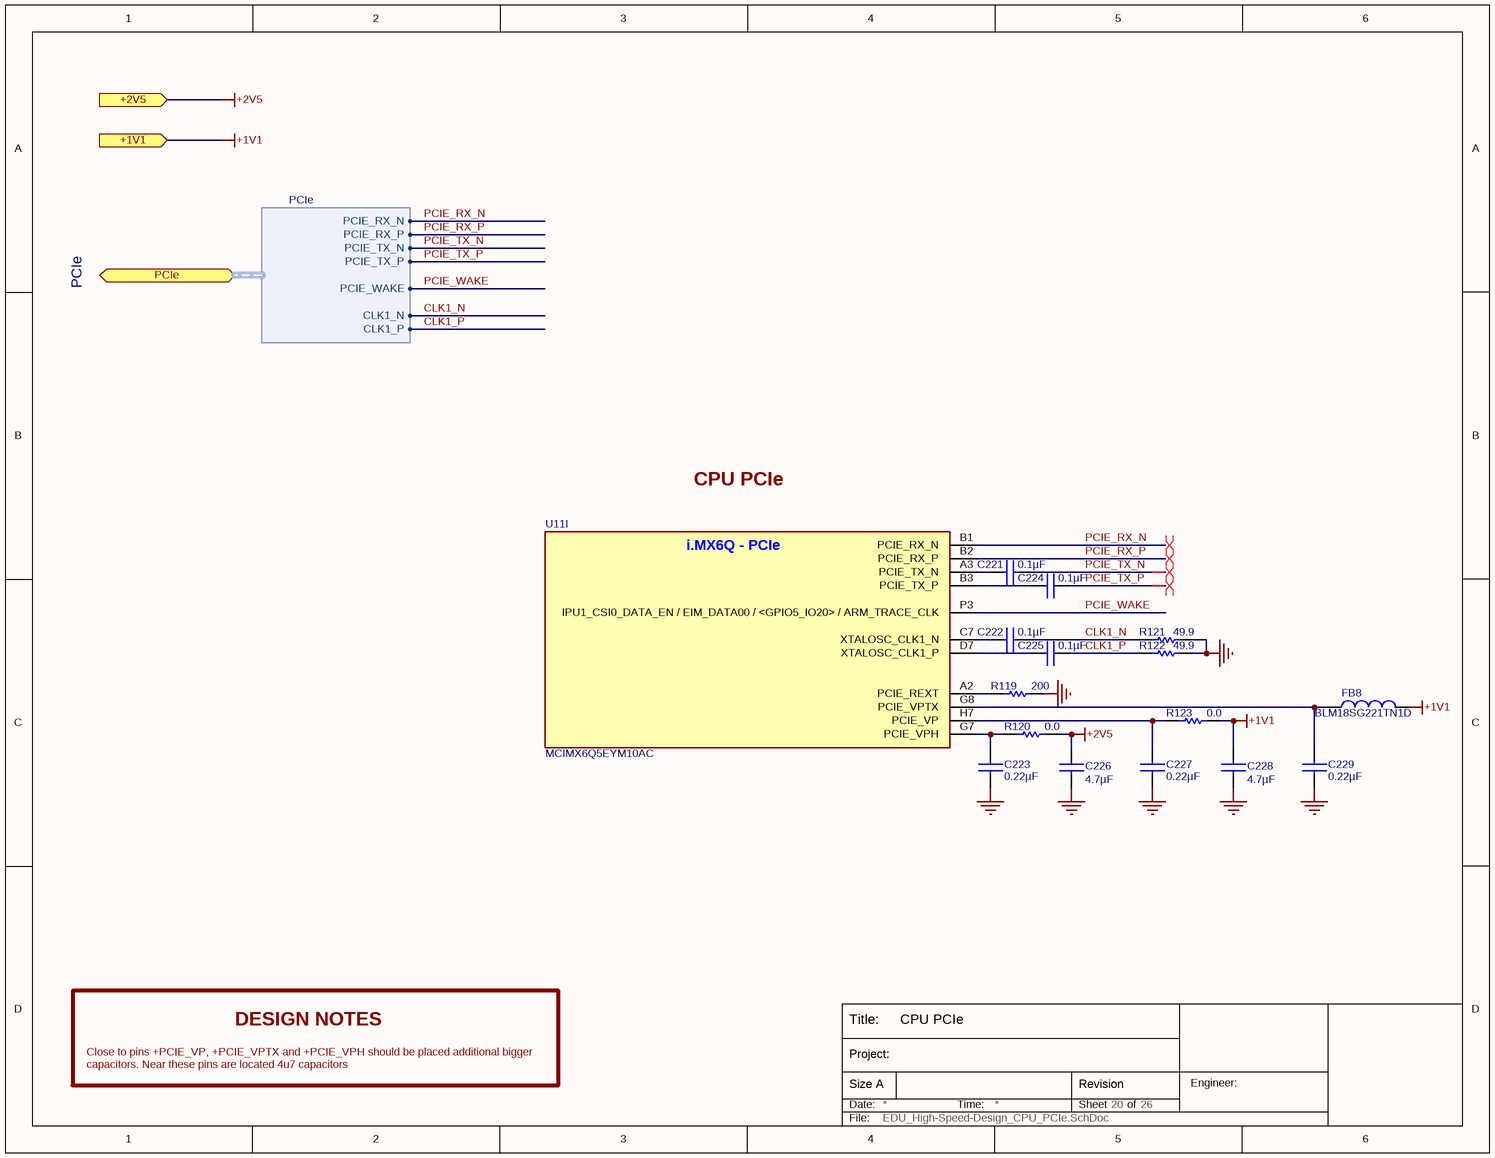
[diagram p14: EDU_High-Speed-Design_CPU_PCIe.SchDoc]

### Parts
C221  0.1µF  [C0402]
C222  0.1µF  [C0402]
C223  0.22µF  [C0402]
C224  0.1µF  [C0402]
C225  0.1µF  [C0402]
C226  4.7µF  [C0402]
C227  0.22µF  [C0402]
C228  4.7µF  [C0402]
C229  0.22µF  [C0402]
FB8  BLM18SG221TN1D  [L0603]
R119  200  [R0402]
R120  0.0  [R0402]
R121  49.9  [R0402]
R122  49.9  [R0402]
R123  0.0  [R0402]
U11  MCIMX6Q5EYM10AC  [MCIMX6Q5EYM10AC]  (part I of 15)

### Ports
+1V1 (in), +2V5 (in), PCIe (bidir, harness PCIe)

### Harnesses
PCIe: PCIE_RX_N, PCIE_TX_P, PCIE_TX_N, PCIE_WAKE, PCIE_RX_P, CLK1_N, CLK1_P

### Nets
+1V1: C228.1 FB8.2 R123.2 ; port +1V1
+2V5: C226.1 R120.2 ; port +2V5
GND: C223.2 C226.2 C227.2 C228.2 C229.2 R119.1 R121.1 R122.1
CLK1_N: C222.2 R121.2 ; port PCIe.CLK1_N
CLK1_P: C225.2 R122.2 ; port PCIe.CLK1_P
PCIE_RX_N: U11.B1(PCIE_RX_N) ; port PCIe.PCIE_RX_N
PCIE_RX_P: U11.B2(PCIE_RX_P) ; port PCIe.PCIE_RX_P
PCIE_TX_N: C221.2 ; port PCIe.PCIE_TX_N
PCIE_TX_P: C224.2 ; port PCIe.PCIE_TX_P
PCIE_WAKE: U11.P3(IPU1_CSI0_DATA_EN_/_EIM_DATA00_/_<GPIO5_IO20>_/_ARM_TRACE_CLK) ; port PCIe.PCIE_WAKE
NetC221_1: C221.1 U11.A3(PCIE_TX_N)
NetC222_1: C222.1 U11.C7(XTALOSC_CLK1_N)
NetC223_1: C223.1 R120.1 U11.G7(PCIE_VPH)
NetC224_1: C224.1 U11.B3(PCIE_TX_P)
NetC225_1: C225.1 U11.D7(XTALOSC_CLK1_P)
NetC227_1: C227.1 R123.1 U11.H7(PCIE_VP)
NetC229_1: C229.1 FB8.1 U11.G8(PCIE_VPTX)
NetR119_2: R119.2 U11.A2(PCIE_REXT)

### Layout directives
differential pair: PCIE_RX_N, PCIE_RX_P, PCIE_TX_N, PCIE_TX_P

### Notes on the sheet
- PCIe
- CPU PCIe
- DESIGN NOTES
- Close to pins +PCIE_VP, +PCIE_VPTX and +PCIE_VPH should be placed additional bigger capacitors. Near these pins are located 4u7 capacitors
- Title:
- Date:
- Size A
- Project:
- Time:
- Sheet
- Revision
- of
- Engineer:
- File:
- (in symbol MCIMX6Q5EYM10AC, part I) i.MX6Q - PCIe

### Library data of the parts
C221 C222 C224 C225 = C1005X5R1H104K: as C219 on sheet EDU_High-Speed-Design_CPU_HDMI; Capacitance: 0.1µF; Manufacturer Part Number 1: C1005X5R1H104K; Voltage: 50V; Supplier 1: Digi-Key; Supplier Part Number 1: 445-5942-1-ND; ComponentLink1URL: http://www.tdk.co.jp/tefe02/e412_c.pdf; ComponentLink1Description: http://www.tdk.co.jp/tefe02/e412_c.pdf
C223 C227 C229 = C1005X5R1E224M: as C230 on sheet EDU_High-Speed-Design_CPU_LVDS; Capacitance: 0.22µF; Manufacturer Part Number 1: C1005X5R1E224M; Voltage: 25V; Supplier 1: Digi-Key; Supplier Part Number 1: 445-5945-1-ND; ComponentLink1URL: http://www.tdk.co.jp/tefe02/e412_c.pdf; ComponentLink1Description: http://www.tdk.co.jp/tefe02/e412_c.pdf
C226 C228 = C1005X5R1A475M: as C231 on sheet EDU_High-Speed-Design_CPU_LVDS; Supplier 1: Digi-Key; Supplier Part Number 1: 445-8023-1-ND; Manufacturer Part Number 1: C1005X5R1A475M; Capacitance: 4.7µF; Voltage: 10V; ComponentLink1URL: http://www.tdk.com/pdf/general_B11.pdf; ComponentLink1Description: http://www.tdk.com/pdf/general_B11.pdf
FB8 = BLM18SG221TN1D: FERRITE CHIP 220 OHM 2500MA 0603; Manufacturer 1: Murata Electronics North America; Supplier 1: Digi-Key; Supplier Part Number 1: 490-5225-1-ND; Manufacturer Part Number 1: BLM18SG221TN1D; ComponentLink1URL: http://search.murata.co.jp/Ceramy/image/img/PDF/ENG/L0110S0100BLM18S.pdf; ComponentLink1Description: http://search.murata.co.jp/Ceramy/image/img/PDF/ENG/L0110S0100BLM18S.pdf
R119 = CRCW0402200RFKED: RES 200 OHM 1/16W 1% 0402 SMD; Manufacturer 1: Vishay Dale; Supplier 1: Digi-Key; Manufacturer Part Number 1: CRCW0402200RFKED; Resistance: 200; ComponentLink1URL: http://www.vishay.com/doc?20035; ComponentLink1Description: http://www.vishay.com/doc?20035; Supplier Part Number 1: 541-200LCT-ND
R120 R123 = RC0402JR-070RL: as R127 on sheet EDU_High-Speed-Design_CPU_LVDS; Manufacturer Part Number 1: RC0402JR-070RL; Resistance: 0.0; Supplier 1: Digi-Key; Supplier Part Number 1: 311-0.0JRCT-ND; ComponentLink1URL: http://www.yageo.com/documents/recent/PYu-RC0402_51_RoHS_L_6.pdf; ComponentLink1Description: http://www.yageo.com/documents/recent/PYu-RC0402_51_RoHS_L_6.pdf
R121 R122 = RC0402FR-0749R9L: RES 49.9 OHM 1/16W 1% 0402 SMD; Manufacturer 1: Yageo; Manufacturer Part Number 1: RC0402FR-0749R9L; Resistance: 49.9; Supplier 1: Digi-Key; Supplier Part Number 1: 311-49.9LRCT-ND; ComponentLink1URL: http://www.yageo.com/documents/recent/PYu-RC0402_51_RoHS_L_6.pdf; ComponentLink1Description: http://www.yageo.com/documents/recent/PYu-RC0402_51_RoHS_L_6.pdf
U11 = MCIMX6Q5EYM10AC: as U11 on sheet EDU_High-Speed-Design_CPU_LVDS; Supplier 1: Digi-Key; Manufacturer Part Number 1: MCIMX6Q5EYM10AC; Supplier Part Number 1: MCIMX6Q5EYM10AC-ND

## Sheet EDU_High-Speed-Design_CPU_DDR3.SchDoc: CPU DDR3
size 431 x 279 mm; Date: not used; ApprovedBy: not used; CheckedBy: not used; Author: not used; DrawnBy: not used; Engineer: Podlesnyi Vasilii; Organization: not used; Address4: not used; Revision: 0.1; SheetNumber: 13; SheetTotal: 26; ProjectTitle: EDU High-Speed Design; Time: not used; ImagePath: not used; Application_BuildNumber: not used
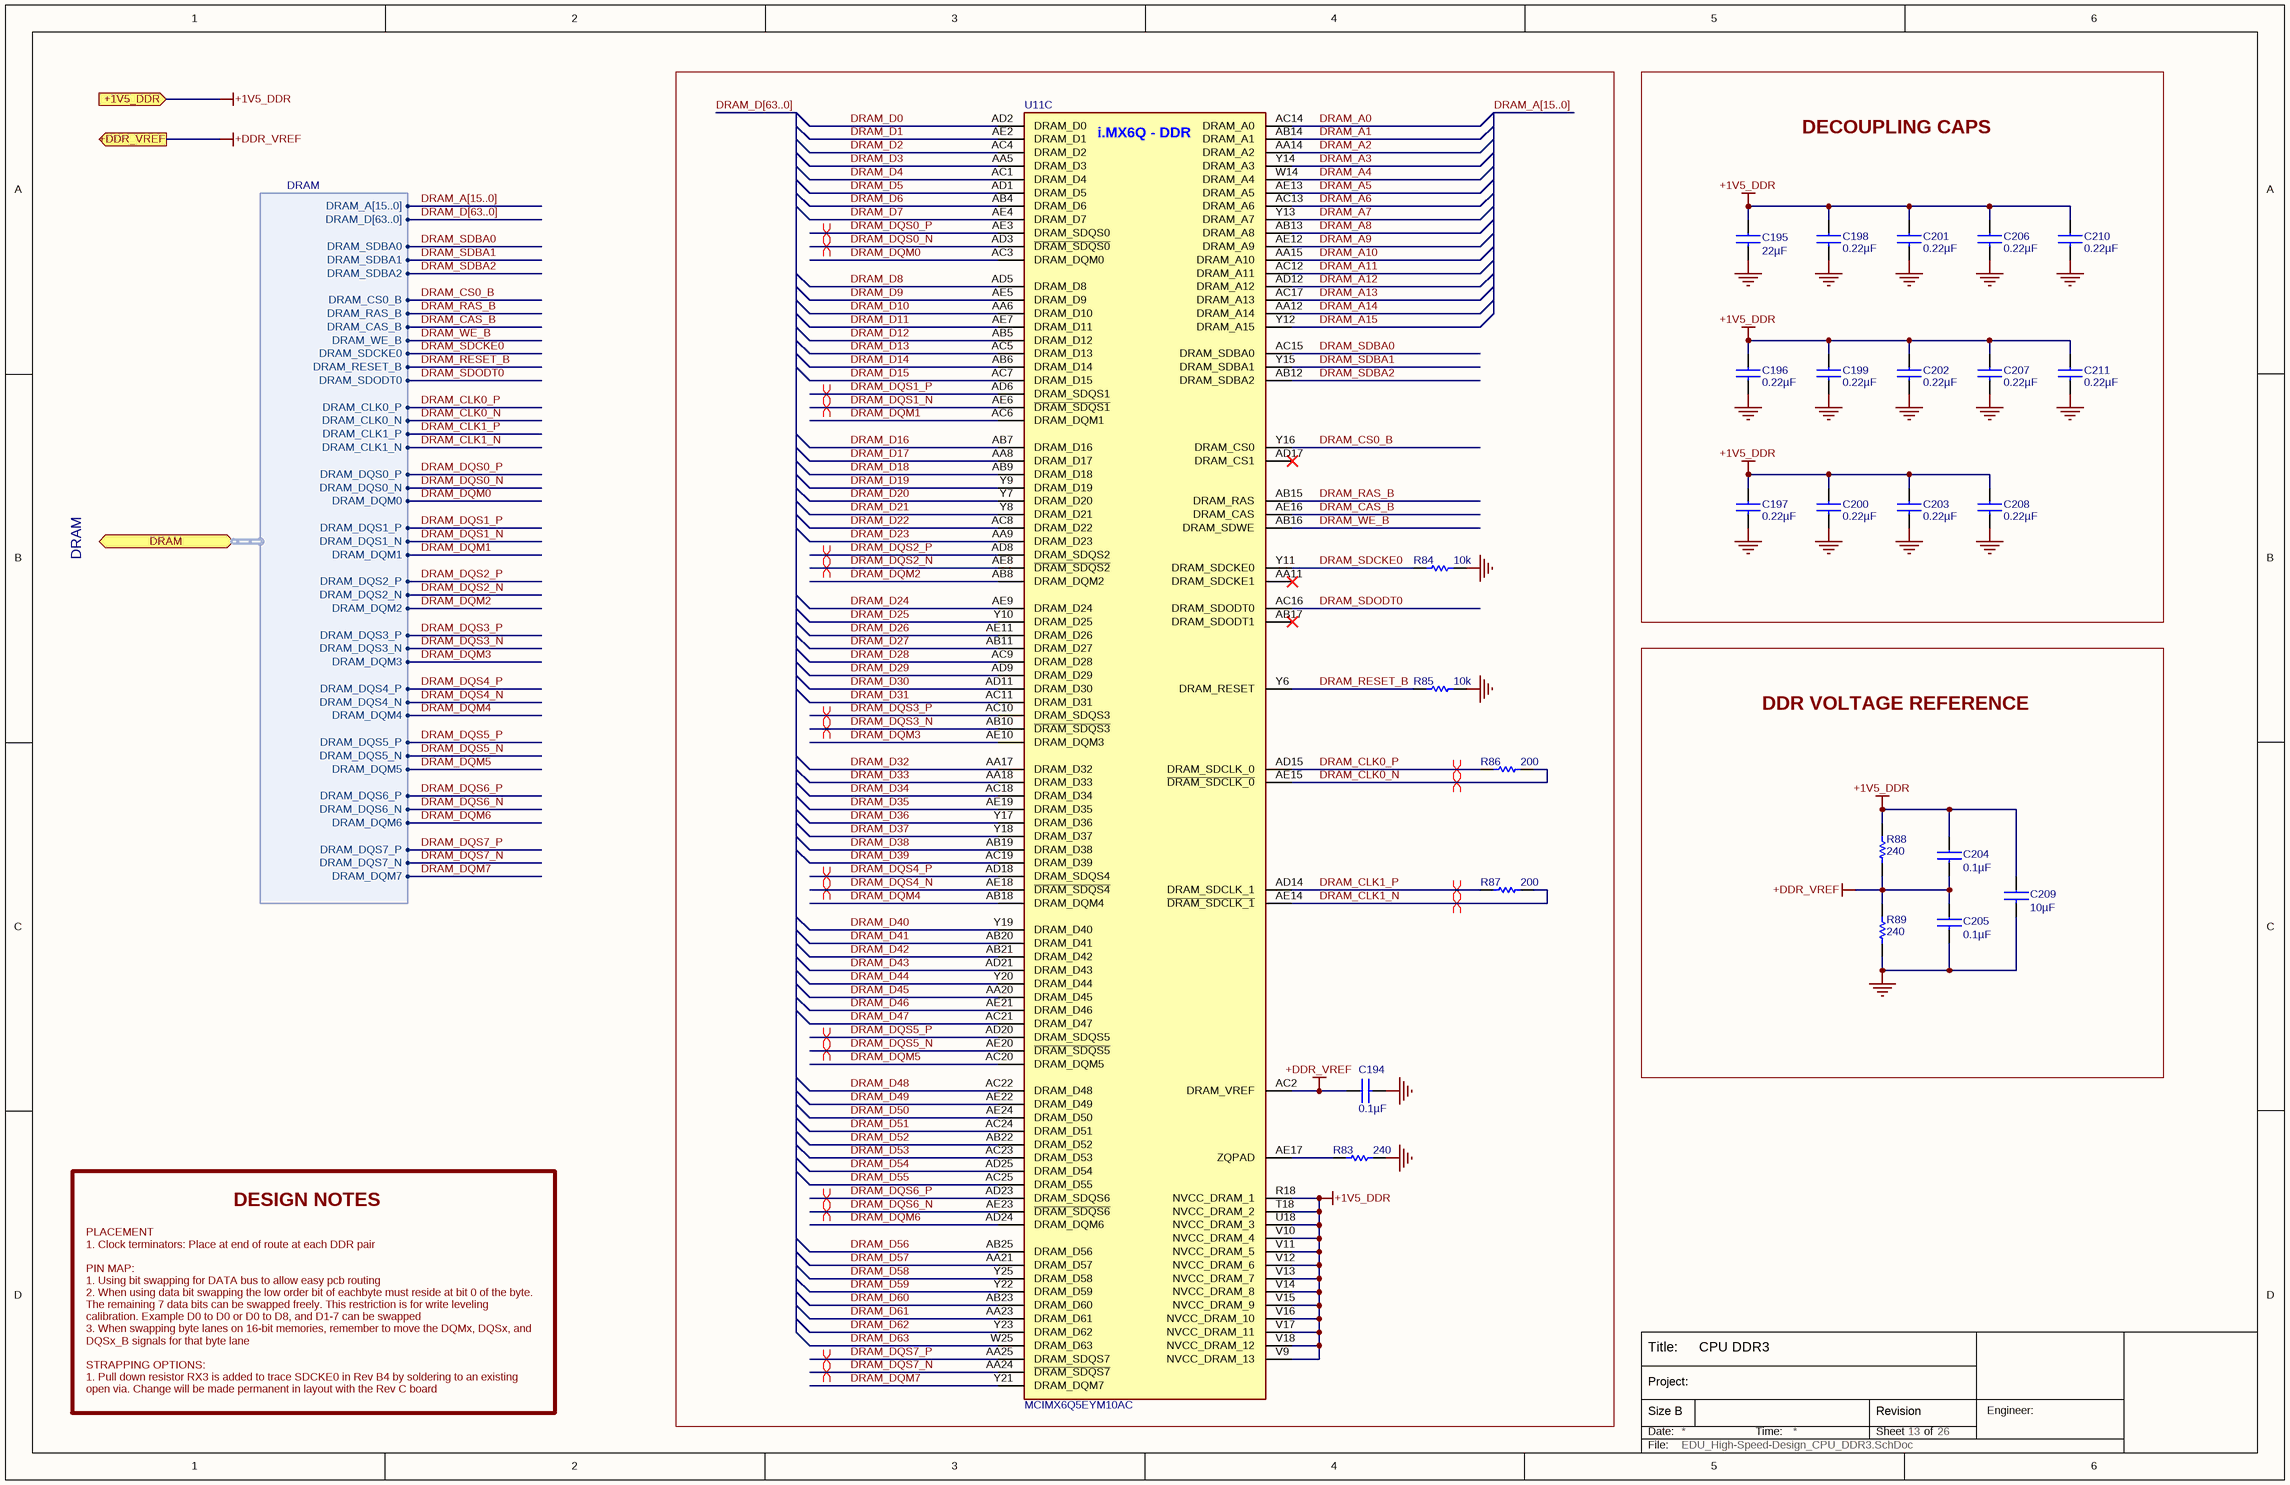
[diagram p15: EDU_High-Speed-Design_CPU_DDR3.SchDoc]

### Parts
C194  0.1µF  [C0402]
C195  22µF  [C0603]
C196  0.22µF  [C0402]
C197  0.22µF  [C0402]
C198  0.22µF  [C0402]
C199  0.22µF  [C0402]
C200  0.22µF  [C0402]
C201  0.22µF  [C0402]
C202  0.22µF  [C0402]
C203  0.22µF  [C0402]
C204  0.1µF  [C0402]
C205  0.1µF  [C0402]
C206  0.22µF  [C0402]
C207  0.22µF  [C0402]
C208  0.22µF  [C0402]
C209  10µF  [C0603]
C210  0.22µF  [C0402]
C211  0.22µF  [C0402]
R83  240  [R0402]
R84  10k  [R0402]
R85  10k  [R0402]
R86  200  [R0402]
R87  200  [R0402]
R88  240  [R0402]
R89  240  [R0402]
U11  MCIMX6Q5EYM10AC  [MCIMX6Q5EYM10AC]  (part C of 15)

### Blocks framed on the sheet
DECOUPLING CAPS: C195-C203 C206-C208 C210 C211
DDR VOLTAGE REFERENCE: C204 C205 C209 R88 R89

### Ports
+1V5_DDR (in), +DDR_VREF (out), DRAM (bidir, harness DRAM)

### Harnesses
DRAM: DRAM_SDCKE0, DRAM_RESET_B, DRAM_CLK0_N, DRAM_CLK1_N, DRAM_CLK1_P, DRAM_SDODT0, DRAM_CS0_B, DRAM_RAS_B, DRAM_CAS_B, DRAM_WE_B, DRAM_A[15..0], DRAM_SDBA0, DRAM_SDBA1, DRAM_SDBA2, DRAM_CLK0_P, DRAM_D[63..0], DRAM_DQS0_P, DRAM_DQS0_N, DRAM_DQM0, DRAM_DQS1_P, DRAM_DQS1_N, DRAM_DQM1, DRAM_DQS2_P, DRAM_DQS2_N, DRAM_DQM2, DRAM_DQS3_P, DRAM_DQS3_N, DRAM_DQM3, DRAM_DQS4_P, DRAM_DQS4_N, DRAM_DQM4, DRAM_DQS5_P, DRAM_DQS5_N, DRAM_DQM5, DRAM_DQS6_P, DRAM_DQS6_N, DRAM_DQM6, DRAM_DQS7_P, DRAM_DQS7_N, DRAM_DQM7

### Nets
+1V5_DDR: C195.1 C196.1 C197.1 C198.1 C199.1 C200.1 C201.1 C202.1 C203.1 C204.1 C206.1 C207.1 C208.1 C209.1 C210.1 C211.1 R88.1 U11.R18(NVCC_DRAM_1) U11.T18(NVCC_DRAM_2) U11.U18(NVCC_DRAM_3) U11.V9(NVCC_DRAM_13) U11.V10(NVCC_DRAM_4) U11.V11(NVCC_DRAM_5) U11.V12(NVCC_DRAM_6) U11.V13(NVCC_DRAM_7) U11.V14(NVCC_DRAM_8) U11.V15(NVCC_DRAM_9) U11.V16(NVCC_DRAM_10) U11.V17(NVCC_DRAM_11) U11.V18(NVCC_DRAM_12) ; port +1V5_DDR
+DDR_VREF: C194.1 C204.2 C205.1 R88.2 R89.1 U11.AC2(DRAM_VREF) ; port +DDR_VREF
GND: C194.2 C195.2 C196.2 C197.2 C198.2 C199.2 C200.2 C201.2 C202.2 C203.2 C205.2 C206.2 C207.2 C208.2 C209.2 C210.2 C211.2 R83.1 R84.2 R85.2 R89.2
DRAM_A0: U11.AC14(DRAM_A0)
DRAM_A1: U11.AB14(DRAM_A1)
DRAM_A2: U11.AA14(DRAM_A2)
DRAM_A3: U11.Y14(DRAM_A3)
DRAM_A4: U11.W14(DRAM_A4)
DRAM_A5: U11.AE13(DRAM_A5)
DRAM_A6: U11.AC13(DRAM_A6)
DRAM_A7: U11.Y13(DRAM_A7)
DRAM_A8: U11.AB13(DRAM_A8)
DRAM_A9: U11.AE12(DRAM_A9)
DRAM_A10: U11.AA15(DRAM_A10)
DRAM_A11: U11.AC12(DRAM_A11)
DRAM_A12: U11.AD12(DRAM_A12)
DRAM_A13: U11.AC17(DRAM_A13)
DRAM_A14: U11.AA12(DRAM_A14)
DRAM_A15: U11.Y12(DRAM_A15)
DRAM_CAS_B: U11.AE16(DRAM_CAS) ; port DRAM.DRAM_CAS_B
DRAM_CLK0_N: R86.2 U11.AE15(~{DRAM_SDCLK_0}) ; port DRAM.DRAM_CLK0_N
DRAM_CLK0_P: R86.1 U11.AD15(DRAM_SDCLK_0) ; port DRAM.DRAM_CLK0_P
DRAM_CLK1_N: R87.2 U11.AE14(~{DRAM_SDCLK_1}) ; port DRAM.DRAM_CLK1_N
DRAM_CLK1_P: R87.1 U11.AD14(DRAM_SDCLK_1) ; port DRAM.DRAM_CLK1_P
DRAM_CS0_B: U11.Y16(DRAM_CS0) ; port DRAM.DRAM_CS0_B
DRAM_D0: U11.AD2(DRAM_D0)
DRAM_D1: U11.AE2(DRAM_D1)
DRAM_D2: U11.AC4(DRAM_D2)
DRAM_D3: U11.AA5(DRAM_D3)
DRAM_D4: U11.AC1(DRAM_D4)
DRAM_D5: U11.AD1(DRAM_D5)
DRAM_D6: U11.AB4(DRAM_D6)
DRAM_D7: U11.AE4(DRAM_D7)
DRAM_D8: U11.AD5(DRAM_D8)
DRAM_D9: U11.AE5(DRAM_D9)
DRAM_D10: U11.AA6(DRAM_D10)
DRAM_D11: U11.AE7(DRAM_D11)
DRAM_D12: U11.AB5(DRAM_D12)
DRAM_D13: U11.AC5(DRAM_D13)
DRAM_D14: U11.AB6(DRAM_D14)
DRAM_D15: U11.AC7(DRAM_D15)
DRAM_D16: U11.AB7(DRAM_D16)
DRAM_D17: U11.AA8(DRAM_D17)
DRAM_D18: U11.AB9(DRAM_D18)
DRAM_D19: U11.Y9(DRAM_D19)
DRAM_D20: U11.Y7(DRAM_D20)
DRAM_D21: U11.Y8(DRAM_D21)
DRAM_D22: U11.AC8(DRAM_D22)
DRAM_D23: U11.AA9(DRAM_D23)
DRAM_D24: U11.AE9(DRAM_D24)
DRAM_D25: U11.Y10(DRAM_D25)
DRAM_D26: U11.AE11(DRAM_D26)
DRAM_D27: U11.AB11(DRAM_D27)
DRAM_D28: U11.AC9(DRAM_D28)
DRAM_D29: U11.AD9(DRAM_D29)
DRAM_D30: U11.AD11(DRAM_D30)
DRAM_D31: U11.AC11(DRAM_D31)
DRAM_D32: U11.AA17(DRAM_D32)
DRAM_D33: U11.AA18(DRAM_D33)
DRAM_D34: U11.AC18(DRAM_D34)
DRAM_D35: U11.AE19(DRAM_D35)
DRAM_D36: U11.Y17(DRAM_D36)
DRAM_D37: U11.Y18(DRAM_D37)
DRAM_D38: U11.AB19(DRAM_D38)
DRAM_D39: U11.AC19(DRAM_D39)
DRAM_D40: U11.Y19(DRAM_D40)
DRAM_D41: U11.AB20(DRAM_D41)
DRAM_D42: U11.AB21(DRAM_D42)
DRAM_D43: U11.AD21(DRAM_D43)
DRAM_D44: U11.Y20(DRAM_D44)
DRAM_D45: U11.AA20(DRAM_D45)
DRAM_D46: U11.AE21(DRAM_D46)
DRAM_D47: U11.AC21(DRAM_D47)
DRAM_D48: U11.AC22(DRAM_D48)
DRAM_D49: U11.AE22(DRAM_D49)
DRAM_D50: U11.AE24(DRAM_D50)
DRAM_D51: U11.AC24(DRAM_D51)
DRAM_D52: U11.AB22(DRAM_D52)
DRAM_D53: U11.AC23(DRAM_D53)
DRAM_D54: U11.AD25(DRAM_D54)
DRAM_D55: U11.AC25(DRAM_D55)
DRAM_D56: U11.AB25(DRAM_D56)
DRAM_D57: U11.AA21(DRAM_D57)
DRAM_D58: U11.Y25(DRAM_D58)
DRAM_D59: U11.Y22(DRAM_D59)
DRAM_D60: U11.AB23(DRAM_D60)
DRAM_D61: U11.AA23(DRAM_D61)
DRAM_D62: U11.Y23(DRAM_D62)
DRAM_D63: U11.W25(DRAM_D63)
DRAM_DQM0: U11.AC3(DRAM_DQM0) ; port DRAM.DRAM_DQM0
DRAM_DQM1: U11.AC6(DRAM_DQM1) ; port DRAM.DRAM_DQM1
DRAM_DQM2: U11.AB8(DRAM_DQM2) ; port DRAM.DRAM_DQM2
DRAM_DQM3: U11.AE10(DRAM_DQM3) ; port DRAM.DRAM_DQM3
DRAM_DQM4: U11.AB18(DRAM_DQM4) ; port DRAM.DRAM_DQM4
DRAM_DQM5: U11.AC20(DRAM_DQM5) ; port DRAM.DRAM_DQM5
DRAM_DQM6: U11.AD24(DRAM_DQM6) ; port DRAM.DRAM_DQM6
DRAM_DQM7: U11.Y21(DRAM_DQM7) ; port DRAM.DRAM_DQM7
DRAM_DQS0_N: U11.AD3(~{DRAM_SDQS0}) ; port DRAM.DRAM_DQS0_N
DRAM_DQS0_P: U11.AE3(DRAM_SDQS0) ; port DRAM.DRAM_DQS0_P
DRAM_DQS1_N: U11.AE6(~{DRAM_SDQS1}) ; port DRAM.DRAM_DQS1_N
DRAM_DQS1_P: U11.AD6(DRAM_SDQS1) ; port DRAM.DRAM_DQS1_P
DRAM_DQS2_N: U11.AE8(~{DRAM_SDQS2}) ; port DRAM.DRAM_DQS2_N
DRAM_DQS2_P: U11.AD8(DRAM_SDQS2) ; port DRAM.DRAM_DQS2_P
DRAM_DQS3_N: U11.AB10(~{DRAM_SDQS3}) ; port DRAM.DRAM_DQS3_N
DRAM_DQS3_P: U11.AC10(DRAM_SDQS3) ; port DRAM.DRAM_DQS3_P
DRAM_DQS4_N: U11.AE18(~{DRAM_SDQS4}) ; port DRAM.DRAM_DQS4_N
DRAM_DQS4_P: U11.AD18(DRAM_SDQS4) ; port DRAM.DRAM_DQS4_P
DRAM_DQS5_N: U11.AE20(~{DRAM_SDQS5}) ; port DRAM.DRAM_DQS5_N
DRAM_DQS5_P: U11.AD20(DRAM_SDQS5) ; port DRAM.DRAM_DQS5_P
DRAM_DQS6_N: U11.AE23(~{DRAM_SDQS6}) ; port DRAM.DRAM_DQS6_N
DRAM_DQS6_P: U11.AD23(DRAM_SDQS6) ; port DRAM.DRAM_DQS6_P
DRAM_DQS7_N: U11.AA24(~{DRAM_SDQS7}) ; port DRAM.DRAM_DQS7_N
DRAM_DQS7_P: U11.AA25(DRAM_SDQS7) ; port DRAM.DRAM_DQS7_P
DRAM_RAS_B: U11.AB15(DRAM_RAS) ; port DRAM.DRAM_RAS_B
DRAM_RESET_B: R85.1 U11.Y6(DRAM_RESET) ; port DRAM.DRAM_RESET_B
DRAM_SDBA0: U11.AC15(DRAM_SDBA0) ; port DRAM.DRAM_SDBA0
DRAM_SDBA1: U11.Y15(DRAM_SDBA1) ; port DRAM.DRAM_SDBA1
DRAM_SDBA2: U11.AB12(DRAM_SDBA2) ; port DRAM.DRAM_SDBA2
DRAM_SDCKE0: R84.1 U11.Y11(DRAM_SDCKE0) ; port DRAM.DRAM_SDCKE0
DRAM_SDODT0: U11.AC16(DRAM_SDODT0) ; port DRAM.DRAM_SDODT0
DRAM_WE_B: U11.AB16(DRAM_SDWE) ; port DRAM.DRAM_WE_B
NetR83_2: R83.2 U11.AE17(ZQPAD)

Not connected (* = marked no-connect by the designer): U11 AA11(DRAM_SDCKE1)* AB17(DRAM_SDODT1)* AD17(DRAM_CS1)*

### Buses and harness runs
bus DRAM_A[15..0]
bus DRAM_D[63..0]

### Layout directives
differential pair: DRAM_CLK0_N, DRAM_CLK0_P, DRAM_CLK1_N, DRAM_CLK1_P, DRAM_DQS0_N, DRAM_DQS0_P, DRAM_DQS1_N, DRAM_DQS1_P, DRAM_DQS2_N, DRAM_DQS2_P, DRAM_DQS3_N, DRAM_DQS3_P, DRAM_DQS4_N, DRAM_DQS4_P, DRAM_DQS5_N, DRAM_DQS5_P, DRAM_DQS6_N, DRAM_DQS6_P, DRAM_DQS7_N, DRAM_DQS7_P

### Notes on the sheet
- DRAM
- DESIGN NOTES
- PLACEMENT
  1. Clock terminators: Place at end of route at each DDR pair
  PIN MAP:
  1. Using bit swapping for DATA bus to allow easy pcb routing
  2. When using data bit swapping the low order bit of eachbyte must reside at bit 0 of the byte. The remaining 7 data bits can be swapped freely. This restriction is for write leveling calibration. Example D0 to D0 or D0 to D8, and D1-7 can be swapped
  3. When swapping byte lanes on 16-bit memories, remember to move the DQMx, DQSx, and DQSx_B signals for that byte lane
  STRAPPING OPTIONS:
  1. Pull down resistor RX3 is added to trace SDCKE0 in Rev B4 by soldering to an existing open via. Change will be made permanent in layout with the Rev C board
- Title:
- Date:
- Size B
- Project:
- Time:
- Sheet
- Revision
- of
- Engineer:
- File:
- (in symbol MCIMX6Q5EYM10AC, part C) i.MX6Q - DDR

### Library data of the parts
C194 C204 C205 = C1005X5R1H104K: as C219 on sheet EDU_High-Speed-Design_CPU_HDMI; Capacitance: 0.1µF; Manufacturer Part Number 1: C1005X5R1H104K; Voltage: 50V; Supplier 1: Digi-Key; Supplier Part Number 1: 445-5942-1-ND; ComponentLink1URL: http://www.tdk.co.jp/tefe02/e412_c.pdf; ComponentLink1Description: http://www.tdk.co.jp/tefe02/e412_c.pdf
C195 = GRM188R60G226MEA0L: CAP CER 22UF 4V 20% X5R 0603; Manufacturer 1: Murata Electronics North America; Supplier 1: Digi-Key; Supplier Part Number 1: 490-5526-1-ND; Manufacturer Part Number 1: GRM188R60G226MEA0L; Capacitance: 22µF; Voltage: 4V; ComponentLink1URL: http://www.murata.com/products/catalog/pdf/c02e.pdf; ComponentLink1Description: http://www.murata.com/products/catalog/pdf/c02e.pdf
C196-C203 C206-C208 C210 C211 = C1005X5R1E224M: as C230 on sheet EDU_High-Speed-Design_CPU_LVDS; Capacitance: 0.22µF; Manufacturer Part Number 1: C1005X5R1E224M; Voltage: 25V; Supplier 1: Digi-Key; Supplier Part Number 1: 445-5945-1-ND; ComponentLink1URL: http://www.tdk.co.jp/tefe02/e412_c.pdf; ComponentLink1Description: http://www.tdk.co.jp/tefe02/e412_c.pdf
C209 = C1608X5R0J106M: CAP CER 10UF 6.3V X5R 20% 0603; Manufacturer 1: TDK Corporation; Capacitance: 10µF; Manufacturer Part Number 1: C1608X5R0J106M; Voltage: 6.3V; Supplier 1: Digi-Key; Supplier Part Number 1: 445-4112-1-ND; ComponentLink1URL: http://www.tdk.com/pdf/general_B11.pdf; ComponentLink1Description: http://www.tdk.com/pdf/general_B11.pdf
R83 R88 R89 = RMCF0402FT240R: RES TF 240 OHM 1% 0.0625W 0402; Manufacturer 1: Stackpole Electronics Inc; Manufacturer Part Number 1: RMCF0402FT240R; Resistance: 240; Supplier 1: Digi-Key; Supplier Part Number 1: RMCF0402FT240RCT-ND; ComponentLink1URL: http://www.seielect.com/Catalog/SEI-RMCF.pdf; ComponentLink1Description: http://www.seielect.com/Catalog/SEI-RMCF.pdf
R84 R85 = RC0402FR-0710KL: as R126 on sheet EDU_High-Speed-Design_CPU_LVDS; Manufacturer Part Number 1: RC0402FR-0710KL; Resistance: 10k; Supplier 1: Digi-Key; Supplier Part Number 1: 311-10.0KLRCT-ND; ComponentLink1URL: http://www.yageo.com/documents/recent/PYu-RC0402_51_RoHS_L_6.pdf; ComponentLink1Description: http://www.yageo.com/documents/recent/PYu-RC0402_51_RoHS_L_6.pdf
R86 R87 = CRCW0402200RFKED: as R119 on sheet EDU_High-Speed-Design_CPU_PCIe; Supplier 1: Digi-Key; Manufacturer Part Number 1: CRCW0402200RFKED; Resistance: 200; ComponentLink1URL: http://www.vishay.com/doc?20035; ComponentLink1Description: http://www.vishay.com/doc?20035; Supplier Part Number 1: 541-200LCT-ND
U11 = MCIMX6Q5EYM10AC: as U11 on sheet EDU_High-Speed-Design_CPU_LVDS; Supplier 1: Digi-Key; Manufacturer Part Number 1: MCIMX6Q5EYM10AC; Supplier Part Number 1: MCIMX6Q5EYM10AC-ND

## Sheet EDU_High-Speed-Design_CPU_SD-Card.SchDoc: CPU SD-Card
size 279 x 215 mm; Date: not used; ApprovedBy: not used; CheckedBy: not used; Author: not used; DrawnBy: not used; Engineer: Podlesnyi Vasilii; Organization: not used; Address4: not used; Revision: 0.1; SheetNumber: 15; SheetTotal: 27; ProjectTitle: EDU High-Speed Design; Time: not used; ImagePath: not used; Application_BuildNumber: not used
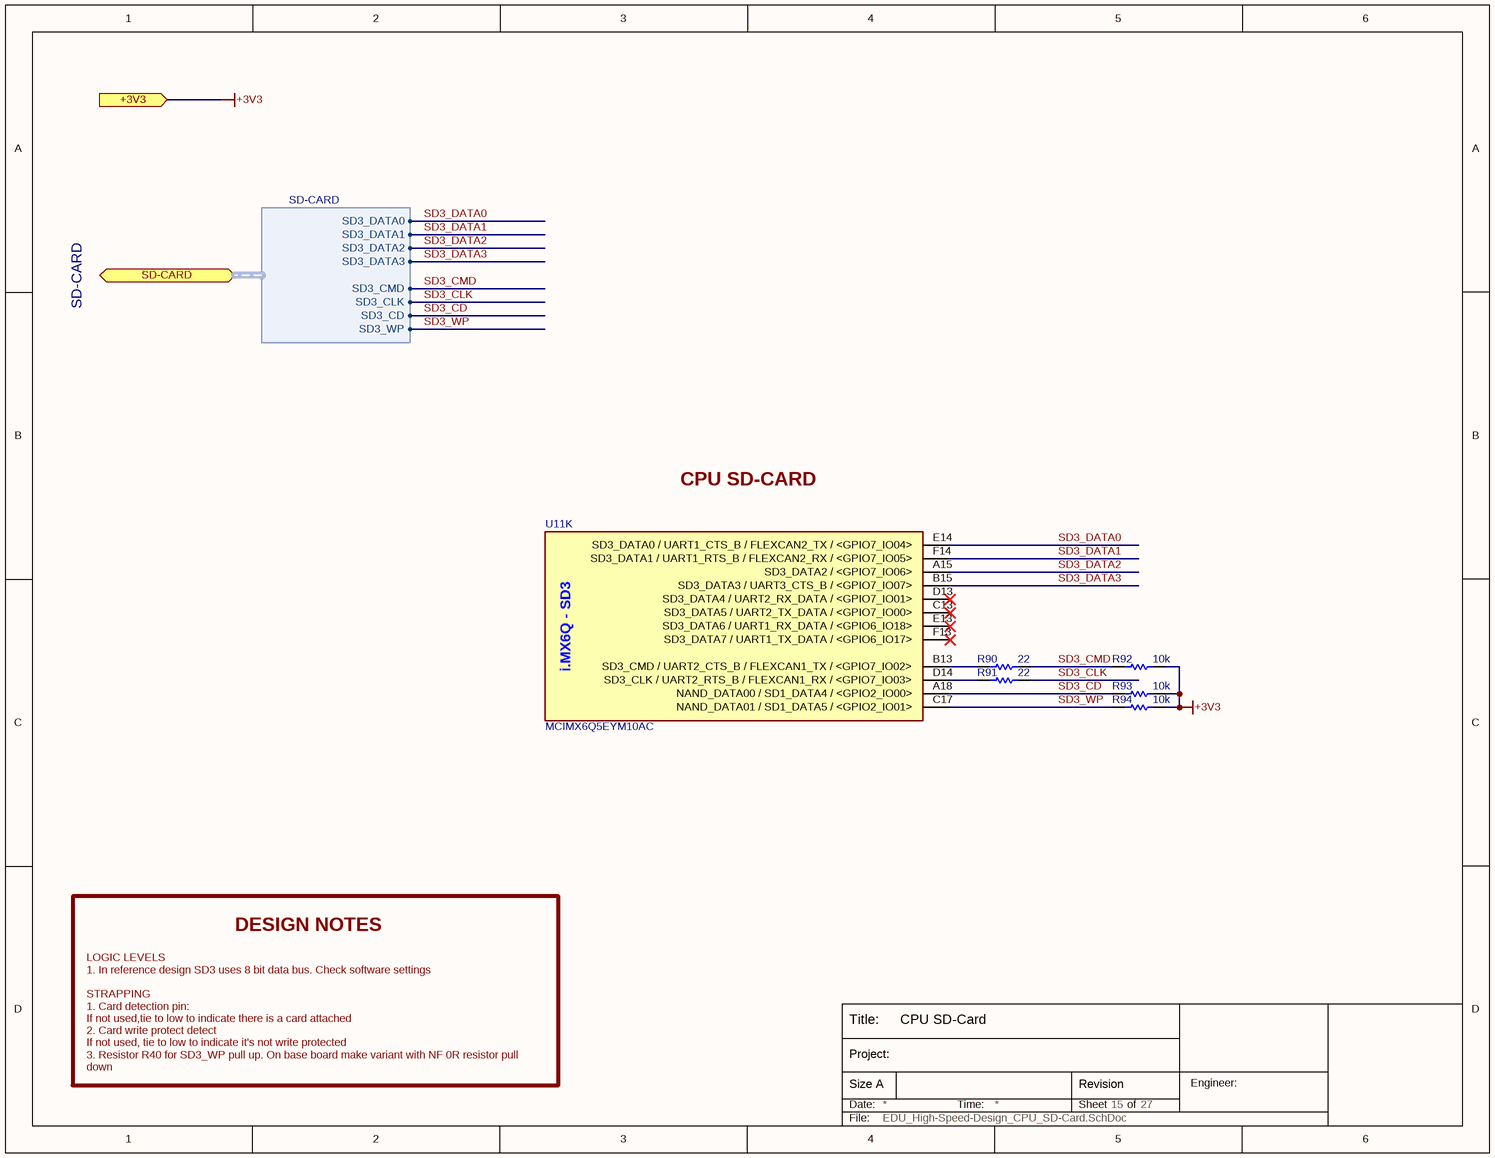
[diagram p16: EDU_High-Speed-Design_CPU_SD-Card.SchDoc]

### Parts
R90  22  [R0402]
R91  22  [R0402]
R92  10k  [R0402]
R93  10k  [R0402]
R94  10k  [R0402]
U11  MCIMX6Q5EYM10AC  [MCIMX6Q5EYM10AC]  (part K of 15)

### Ports
+3V3 (in), SD-CARD (bidir, harness SD-CARD)

### Harnesses
SD-CARD: SD3_DATA0, SD3_DATA3, SD3_DATA2, SD3_CLK, SD3_DATA1, SD3_CD, SD3_WP, SD3_CMD

### Nets
+3V3: R92.2 R93.2 R94.2 ; port +3V3
SD3_CD: R93.1 U11.A18(NAND_DATA00_/_SD1_DATA4_/_<GPIO2_IO00>) ; port SD-CARD.SD3_CD
SD3_CLK: R91.1 ; port SD-CARD.SD3_CLK
SD3_CMD: R90.1 R92.1 ; port SD-CARD.SD3_CMD
SD3_DATA0: U11.E14(SD3_DATA0_/_UART1_CTS_B_/_FLEXCAN2_TX_/_<GPIO7_IO04>) ; port SD-CARD.SD3_DATA0
SD3_DATA1: U11.F14(SD3_DATA1_/_UART1_RTS_B_/_FLEXCAN2_RX_/_<GPIO7_IO05>) ; port SD-CARD.SD3_DATA1
SD3_DATA2: U11.A15(SD3_DATA2_/_<GPIO7_IO06>) ; port SD-CARD.SD3_DATA2
SD3_DATA3: U11.B15(SD3_DATA3_/_UART3_CTS_B_/_<GPIO7_IO07>) ; port SD-CARD.SD3_DATA3
SD3_WP: R94.1 U11.C17(NAND_DATA01_/_SD1_DATA5_/_<GPIO2_IO01>) ; port SD-CARD.SD3_WP
NetR90_2: R90.2 U11.B13(SD3_CMD_/_UART2_CTS_B_/_FLEXCAN1_TX_/_<GPIO7_IO02>)
NetR91_2: R91.2 U11.D14(SD3_CLK_/_UART2_RTS_B_/_FLEXCAN1_RX_/_<GPIO7_IO03>)

Not connected (* = marked no-connect by the designer): U11 C13(SD3_DATA5_/_UART2_TX_DATA_/_<GPIO7_IO00>)* D13(SD3_DATA4_/_UART2_RX_DATA_/_<GPIO7_IO01>)* E13(SD3_DATA6_/_UART1_RX_DATA_/_<GPIO6_IO18>)* F13(SD3_DATA7_/_UART1_TX_DATA_/_<GPIO6_IO17>)*

### Notes on the sheet
- SD-CARD
- CPU SD-CARD
- DESIGN NOTES
- LOGIC LEVELS
  1. In reference design SD3 uses 8 bit data bus. Check software settings
  STRAPPING
  1. Card detection pin:
  If not used,tie to low to indicate there is a card attached
  2. Card write protect detect
  If not used, tie to low to indicate it's not write protected
  3. Resistor R40 for SD3_WP pull up. On base board make variant with NF 0R resistor pull down
- Title:
- Date:
- Size A
- Project:
- Time:
- Sheet
- Revision
- of
- Engineer:
- File:
- (in symbol MCIMX6Q5EYM10AC, part K) i.MX6Q - SD3

### Library data of the parts
R90 R91 = RC0402FR-0722RL: RES 22.0 OHM 1/16W 1% 0402 SMD; Manufacturer 1: Yageo; Manufacturer Part Number 1: RC0402FR-0722RL; Resistance: 22; Supplier 1: Digi-Key; Supplier Part Number 1: 311-22.0LRCT-ND; ComponentLink1URL: http://www.yageo.com/documents/recent/PYu-RC0402_51_RoHS_L_6.pdf; ComponentLink1Description: http://www.yageo.com/documents/recent/PYu-RC0402_51_RoHS_L_6.pdf
R92-R94 = RC0402FR-0710KL: as R126 on sheet EDU_High-Speed-Design_CPU_LVDS; Manufacturer Part Number 1: RC0402FR-0710KL; Resistance: 10k; Supplier 1: Digi-Key; Supplier Part Number 1: 311-10.0KLRCT-ND; ComponentLink1URL: http://www.yageo.com/documents/recent/PYu-RC0402_51_RoHS_L_6.pdf; ComponentLink1Description: http://www.yageo.com/documents/recent/PYu-RC0402_51_RoHS_L_6.pdf
U11 = MCIMX6Q5EYM10AC: as U11 on sheet EDU_High-Speed-Design_CPU_LVDS; Supplier 1: Digi-Key; Manufacturer Part Number 1: MCIMX6Q5EYM10AC; Supplier Part Number 1: MCIMX6Q5EYM10AC-ND

## Sheet EDU_High-Speed-Design_CPU_MMC-Card.SchDoc: CPU MMC-Card
size 279 x 215 mm; Date: not used; ApprovedBy: not used; CheckedBy: not used; Author: not used; DrawnBy: not used; Engineer: Podlesnyi Vasilii; Organization: not used; Address4: not used; Revision: 0.1; SheetNumber: 15; SheetTotal: 26; ProjectTitle: EDU High-Speed Design; Time: not used; ImagePath: not used; Application_BuildNumber: not used
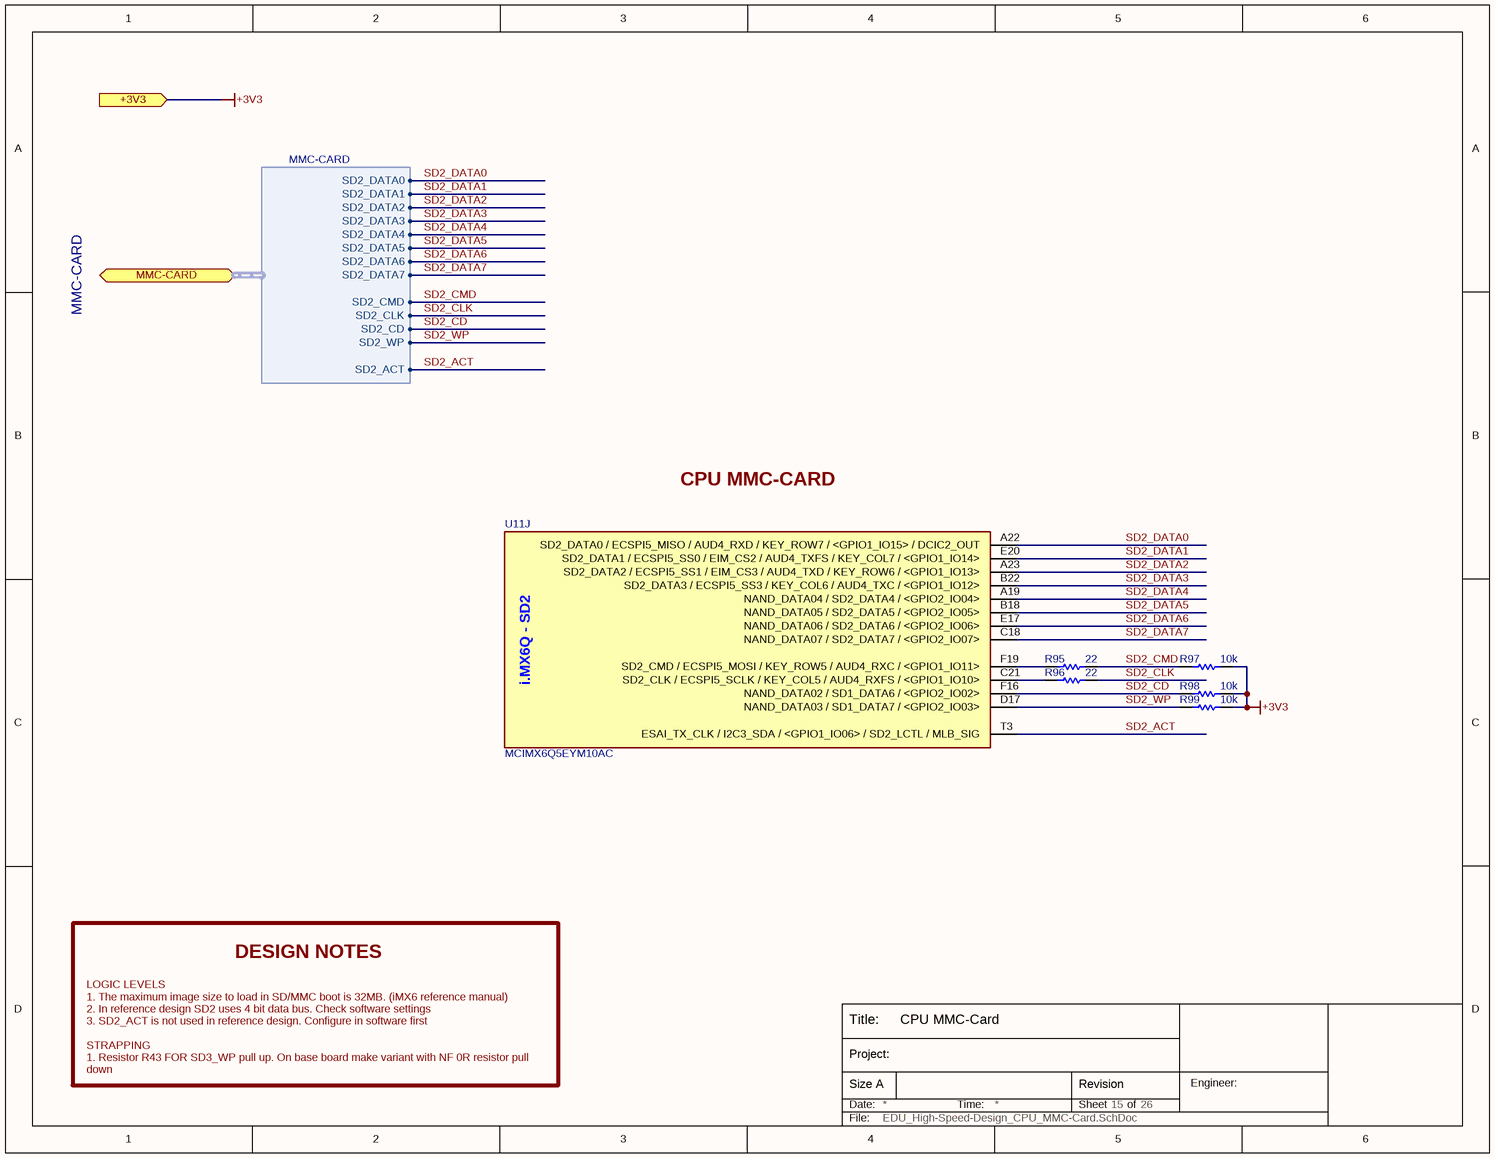
[diagram p17: EDU_High-Speed-Design_CPU_MMC-Card.SchDoc]

### Parts
R95  22  [R0402]
R96  22  [R0402]
R97  10k  [R0402]
R98  10k  [R0402]
R99  10k  [R0402]
U11  MCIMX6Q5EYM10AC  [MCIMX6Q5EYM10AC]  (part J of 15)

### Ports
+3V3 (in), MMC-CARD (bidir, harness MMC-CARD)

### Harnesses
MMC-CARD: SD2_DATA0, SD2_CLK, SD2_CD, SD2_WP, SD2_CMD, SD2_DATA1, SD2_DATA2, SD2_DATA3, SD2_DATA4, SD2_DATA5, SD2_DATA6, SD2_DATA7, SD2_ACT

### Nets
+3V3: R97.2 R98.2 R99.2 ; port +3V3
SD2_ACT: U11.T3(ESAI_TX_CLK_/_I2C3_SDA_/_<GPIO1_IO06>_/_SD2_LCTL_/_MLB_SIG) ; port MMC-CARD.SD2_ACT
SD2_CD: R98.1 U11.F16(NAND_DATA02_/_SD1_DATA6_/_<GPIO2_IO02>) ; port MMC-CARD.SD2_CD
SD2_CLK: R96.1 ; port MMC-CARD.SD2_CLK
SD2_CMD: R95.1 R97.1 ; port MMC-CARD.SD2_CMD
SD2_DATA0: U11.A22(SD2_DATA0_/_ECSPI5_MISO_/_AUD4_RXD_/_KEY_ROW7_/_<GPIO1_IO15>_/_DCIC2_OUT) ; port MMC-CARD.SD2_DATA0
SD2_DATA1: U11.E20(SD2_DATA1_/_ECSPI5_SS0_/_EIM_CS2_/_AUD4_TXFS_/_KEY_COL7_/_<GPIO1_IO14>) ; port MMC-CARD.SD2_DATA1
SD2_DATA2: U11.A23(SD2_DATA2_/_ECSPI5_SS1_/_EIM_CS3_/_AUD4_TXD_/_KEY_ROW6_/_<GPIO1_IO13>) ; port MMC-CARD.SD2_DATA2
SD2_DATA3: U11.B22(SD2_DATA3_/_ECSPI5_SS3_/_KEY_COL6_/_AUD4_TXC_/_<GPIO1_IO12>) ; port MMC-CARD.SD2_DATA3
SD2_DATA4: U11.A19(NAND_DATA04_/_SD2_DATA4_/_<GPIO2_IO04>) ; port MMC-CARD.SD2_DATA4
SD2_DATA5: U11.B18(NAND_DATA05_/_SD2_DATA5_/_<GPIO2_IO05>) ; port MMC-CARD.SD2_DATA5
SD2_DATA6: U11.E17(NAND_DATA06_/_SD2_DATA6_/_<GPIO2_IO06>) ; port MMC-CARD.SD2_DATA6
SD2_DATA7: U11.C18(NAND_DATA07_/_SD2_DATA7_/_<GPIO2_IO07>) ; port MMC-CARD.SD2_DATA7
SD2_WP: R99.1 U11.D17(NAND_DATA03_/_SD1_DATA7_/_<GPIO2_IO03>) ; port MMC-CARD.SD2_WP
NetR95_2: R95.2 U11.F19(SD2_CMD_/_ECSPI5_MOSI_/_KEY_ROW5_/_AUD4_RXC_/_<GPIO1_IO11>)
NetR96_2: R96.2 U11.C21(SD2_CLK_/_ECSPI5_SCLK_/_KEY_COL5_/_AUD4_RXFS_/_<GPIO1_IO10>)

### Notes on the sheet
- MMC-CARD
- CPU MMC-CARD
- DESIGN NOTES
- LOGIC LEVELS
  1. The maximum image size to load in SD/MMC boot is 32MB. (iMX6 reference manual)
  2. In reference design SD2 uses 4 bit data bus. Check software settings
  3. SD2_ACT is not used in reference design. Configure in software first
  STRAPPING
  1. Resistor R43 FOR SD3_WP pull up. On base board make variant with NF 0R resistor pull down
- Title:
- Date:
- Size A
- Project:
- Time:
- Sheet
- Revision
- of
- Engineer:
- File:
- (in symbol MCIMX6Q5EYM10AC, part J) i.MX6Q - SD2

### Library data of the parts
R95 R96 = RC0402FR-0722RL: as R90 on sheet EDU_High-Speed-Design_CPU_SD-Card; Manufacturer Part Number 1: RC0402FR-0722RL; Resistance: 22; Supplier 1: Digi-Key; Supplier Part Number 1: 311-22.0LRCT-ND; ComponentLink1URL: http://www.yageo.com/documents/recent/PYu-RC0402_51_RoHS_L_6.pdf; ComponentLink1Description: http://www.yageo.com/documents/recent/PYu-RC0402_51_RoHS_L_6.pdf
R97-R99 = RC0402FR-0710KL: as R126 on sheet EDU_High-Speed-Design_CPU_LVDS; Manufacturer Part Number 1: RC0402FR-0710KL; Resistance: 10k; Supplier 1: Digi-Key; Supplier Part Number 1: 311-10.0KLRCT-ND; ComponentLink1URL: http://www.yageo.com/documents/recent/PYu-RC0402_51_RoHS_L_6.pdf; ComponentLink1Description: http://www.yageo.com/documents/recent/PYu-RC0402_51_RoHS_L_6.pdf
U11 = MCIMX6Q5EYM10AC: as U11 on sheet EDU_High-Speed-Design_CPU_LVDS; Supplier 1: Digi-Key; Manufacturer Part Number 1: MCIMX6Q5EYM10AC; Supplier Part Number 1: MCIMX6Q5EYM10AC-ND

## Sheet EDU_High-Speed-Design_CPU_SPI_I2C.SchDoc: CPU SPI I2C
size 279 x 215 mm; Date: not used; ApprovedBy: not used; CheckedBy: not used; Author: not used; DrawnBy: not used; Engineer: Podlesnyi Vasilii; Organization: not used; Address4: not used; Revision: 0.1; SheetNumber: 17; SheetTotal: 27; ProjectTitle: EDU High-Speed Design; Time: not used; ImagePath: not used; Application_BuildNumber: not used
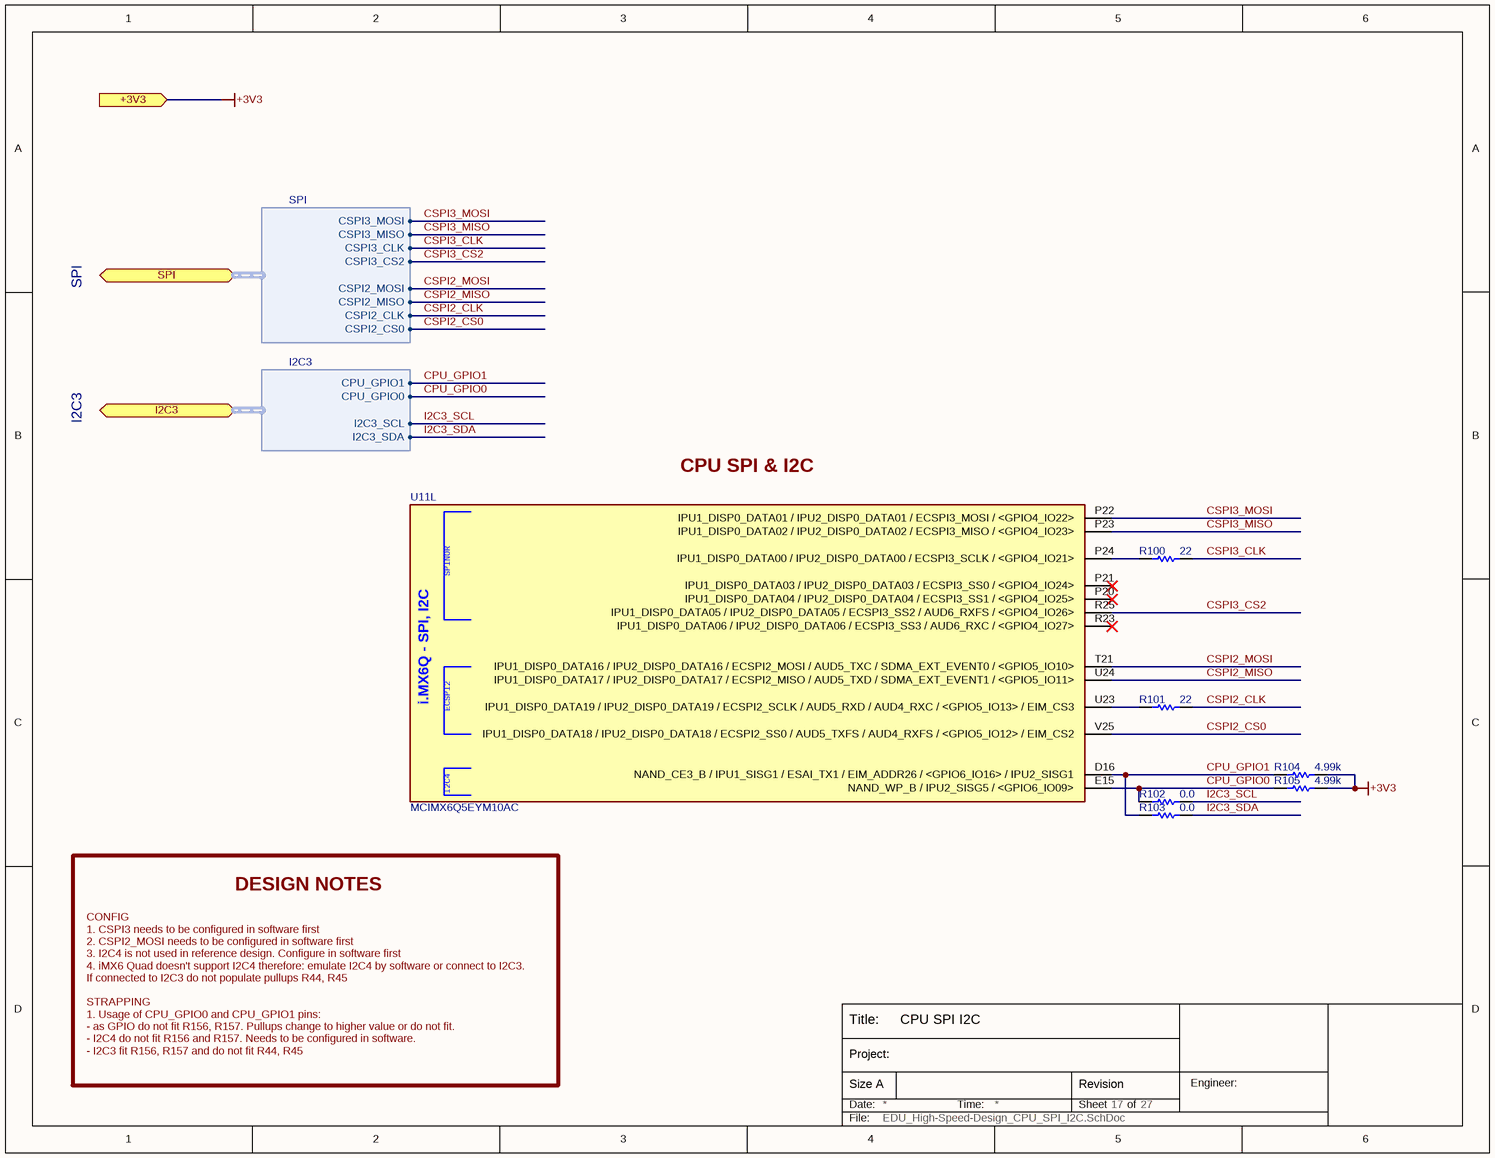
[diagram p18: EDU_High-Speed-Design_CPU_SPI_I2C.SchDoc]

### Parts
R100  22  [R0402]
R101  22  [R0402]
R102  0.0  [R0402]
R103  0.0  [R0402]
R104  4.99k  [R0402]
R105  4.99k  [R0402]
U11  MCIMX6Q5EYM10AC  [MCIMX6Q5EYM10AC]  (part L of 15)

### Ports
+3V3 (in), I2C3 (bidir, harness I2C3), SPI (bidir, harness SPI)

### Harnesses
SPI: CSPI3_MOSI, CSPI3_MISO, CSPI3_CLK, CSPI3_CS2, CSPI2_MOSI, CSPI2_MISO, CSPI2_CLK, CSPI2_CS0
I2C3: CPU_GPIO0, I2C3_SCL, CPU_GPIO1, I2C3_SDA

### Nets
+3V3: R104.1 R105.1 ; port +3V3
CPU_GPIO0: R102.2 R105.2 U11.E15(NAND_WP_B_/_IPU2_SISG5_/_<GPIO6_IO09>) ; port I2C3.CPU_GPIO0
CPU_GPIO1: R103.2 R104.2 U11.D16(NAND_CE3_B_/_IPU1_SISG1_/_ESAI_TX1_/_EIM_ADDR26_/_<GPIO6_IO16>_/_IPU2_SISG1) ; port I2C3.CPU_GPIO1
CSPI2_CLK: R101.1 ; port SPI.CSPI2_CLK
CSPI2_CS0: U11.V25(IPU1_DISP0_DATA18_/_IPU2_DISP0_DATA18_/_ECSPI2_SS0_/_AUD5_TXFS_/_AUD4_RXFS_/_<GPIO5_IO12>_/_EIM_CS2) ; port SPI.CSPI2_CS0
CSPI2_MISO: U11.U24(IPU1_DISP0_DATA17_/_IPU2_DISP0_DATA17_/_ECSPI2_MISO_/_AUD5_TXD_/_SDMA_EXT_EVENT1_/_<GPIO5_IO11>) ; port SPI.CSPI2_MISO
CSPI2_MOSI: U11.T21(IPU1_DISP0_DATA16_/_IPU2_DISP0_DATA16_/_ECSPI2_MOSI_/_AUD5_TXC_/_SDMA_EXT_EVENT0_/_<GPIO5_IO10>) ; port SPI.CSPI2_MOSI
CSPI3_CLK: R100.1 ; port SPI.CSPI3_CLK
CSPI3_CS2: U11.R25(IPU1_DISP0_DATA05_/_IPU2_DISP0_DATA05_/_ECSPI3_SS2_/_AUD6_RXFS_/_<GPIO4_IO26>) ; port SPI.CSPI3_CS2
CSPI3_MISO: U11.P23(IPU1_DISP0_DATA02_/_IPU2_DISP0_DATA02_/_ECSPI3_MISO_/_<GPIO4_IO23>) ; port SPI.CSPI3_MISO
CSPI3_MOSI: U11.P22(IPU1_DISP0_DATA01_/_IPU2_DISP0_DATA01_/_ECSPI3_MOSI_/_<GPIO4_IO22>) ; port SPI.CSPI3_MOSI
I2C3_SCL: R102.1 ; port I2C3.I2C3_SCL
I2C3_SDA: R103.1 ; port I2C3.I2C3_SDA
NetR100_2: R100.2 U11.P24(IPU1_DISP0_DATA00_/_IPU2_DISP0_DATA00_/_ECSPI3_SCLK_/_<GPIO4_IO21>)
NetR101_2: R101.2 U11.U23(IPU1_DISP0_DATA19_/_IPU2_DISP0_DATA19_/_ECSPI2_SCLK_/_AUD5_RXD_/_AUD4_RXC_/_<GPIO5_IO13>_/_EIM_CS3)

Not connected (* = marked no-connect by the designer): U11 P20(IPU1_DISP0_DATA04_/_IPU2_DISP0_DATA04_/_ECSPI3_SS1_/_<GPIO4_IO25>)* P21(IPU1_DISP0_DATA03_/_IPU2_DISP0_DATA03_/_ECSPI3_SS0_/_<GPIO4_IO24>)* R23(IPU1_DISP0_DATA06_/_IPU2_DISP0_DATA06_/_ECSPI3_SS3_/_AUD6_RXC_/_<GPIO4_IO27>)*

### Notes on the sheet
- SPI
- I2C3
- CPU SPI & I2C
- DESIGN NOTES
- CONFIG
  1. CSPI3 needs to be configured in software first
  2. CSPI2_MOSI needs to be configured in software first
  3. I2C4 is not used in reference design. Configure in software first
  4. iMX6 Quad doesn't support I2C4 therefore: emulate I2C4 by software or connect to I2C3.
  If connected to I2C3 do not populate pullups R44, R45
  STRAPPING
  1. Usage of CPU_GPIO0 and CPU_GPIO1 pins:
  - as GPIO do not fit R156, R157. Pullups change to higher value or do not fit.
  - I2C4 do not fit R156 and R157. Needs to be configured in software.
  - I2C3 fit R156, R157 and do not fit R44, R45
- Title:
- Date:
- Size A
- Project:
- Time:
- Sheet
- Revision
- of
- Engineer:
- File:
- (in symbol MCIMX6Q5EYM10AC, part L) SPINOR; i.MX6Q - SPI, I2C; ECSPI2; I2C4

### Library data of the parts
R100 R101 = RC0402FR-0722RL: as R90 on sheet EDU_High-Speed-Design_CPU_SD-Card; Manufacturer Part Number 1: RC0402FR-0722RL; Resistance: 22; Supplier 1: Digi-Key; Supplier Part Number 1: 311-22.0LRCT-ND; ComponentLink1URL: http://www.yageo.com/documents/recent/PYu-RC0402_51_RoHS_L_6.pdf; ComponentLink1Description: http://www.yageo.com/documents/recent/PYu-RC0402_51_RoHS_L_6.pdf
R102 R103 = RC0402JR-070RL: as R127 on sheet EDU_High-Speed-Design_CPU_LVDS; Manufacturer Part Number 1: RC0402JR-070RL; Resistance: 0.0; Supplier 1: Digi-Key; Supplier Part Number 1: 311-0.0JRCT-ND; ComponentLink1URL: http://www.yageo.com/documents/recent/PYu-RC0402_51_RoHS_L_6.pdf; ComponentLink1Description: http://www.yageo.com/documents/recent/PYu-RC0402_51_RoHS_L_6.pdf
R104 R105 = RMCF0402FT4K99: as R124 on sheet EDU_High-Speed-Design_CPU_LVDS; Manufacturer Part Number 1: RMCF0402FT4K99; Resistance: 4.99k; Supplier 1: Digi-Key; Supplier Part Number 1: RMCF0402FT4K99CT-ND; ComponentLink1URL: http://www.seielect.com/Catalog/SEI-RMCF.pdf; ComponentLink1Description: http://www.seielect.com/Catalog/SEI-RMCF.pdf
U11 = MCIMX6Q5EYM10AC: as U11 on sheet EDU_High-Speed-Design_CPU_LVDS; Supplier 1: Digi-Key; Manufacturer Part Number 1: MCIMX6Q5EYM10AC; Supplier Part Number 1: MCIMX6Q5EYM10AC-ND